# Altium project FPGAging_Lite.PrjPcb
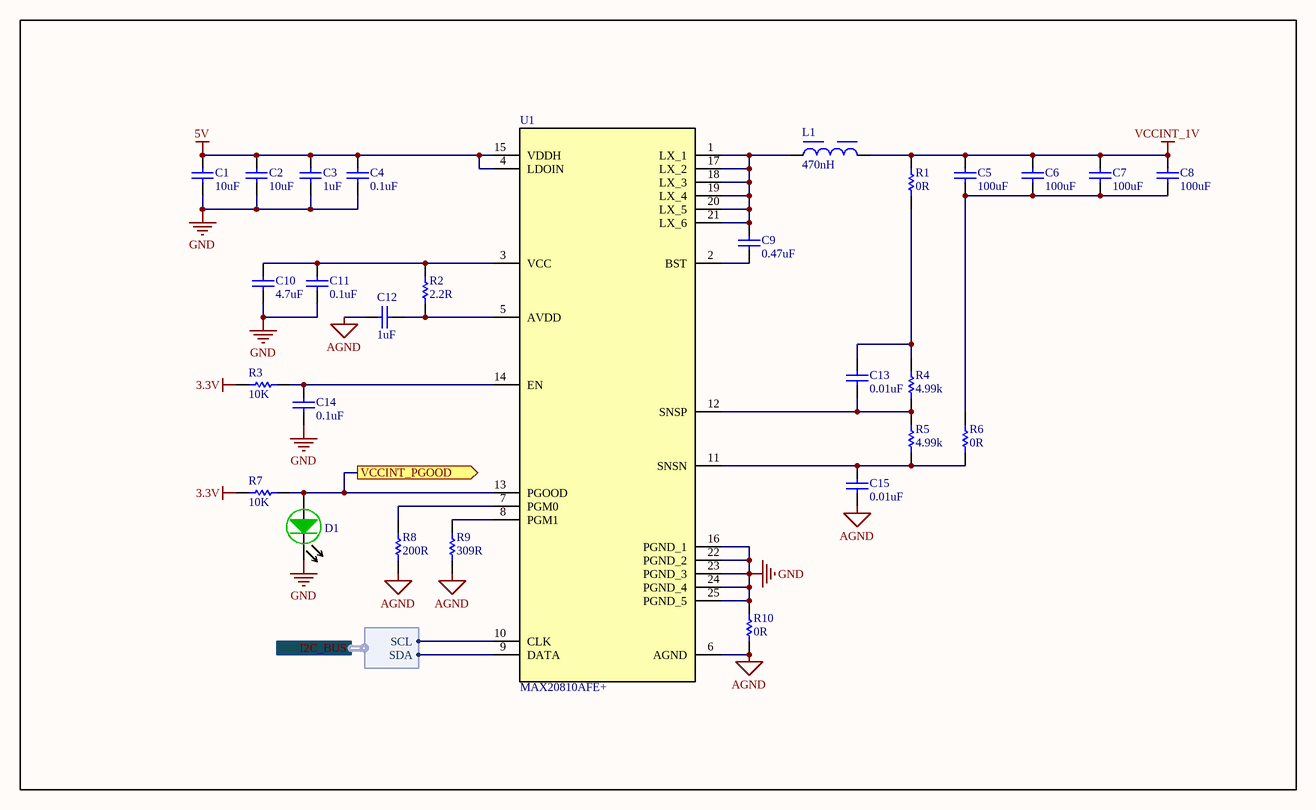
[diagram p0: 01 - POWER SUPPLY.SchDoc]
7 sheets, 221 parts. Net scope: flat (ports and power ports of the same name join across sheets).
Board file: PCB1.PcbDoc
Sheets:
  01 - POWER SUPPLY.SchDoc
  02 - AUX_POWER_SUPPLIES.SchDoc
  03 - FPGA_POWER.SchDoc
  04 - SRAM_FLASH.SchDoc
  05 - MCU.SchDoc
  06 - JTAG.SchDoc
  07 - CONNECTOR_CSKB.SchDoc

## Sheet 01 - POWER SUPPLY.SchDoc
size A3; SheetNumber: 1; SheetTotal: 7

### Parts
C1  value 10uF  [0603-C-R]  (hidden comment: CAP SMD 0603 10uF 10V ±10%)
C2  value 10uF  [0603-C-R]  (hidden comment: CAP SMD 0603 10uF 10V ±10%)
C3  value 1uF  [0402-C-R]  (hidden comment: GRM155R61E105KA12D)
C4  CAPACITANCE: 0.1uF  [0402-C-R]  (hidden comment: GRM155R71C104KA88J)
C5  value 100uF  [1210-C-R]  (hidden comment: GRT32EC70J107ME13L)
C6  value 100uF  [1210-C-R]  (hidden comment: GRT32EC70J107ME13L)
C7  value 100uF  [1210-C-R]  (hidden comment: GRT32EC70J107ME13L)
C8  value 100uF  [1210-C-R]  (hidden comment: GRT32EC70J107ME13L)
C9  CAPACITANCE: 0.47uF  [0402-C-R]  (hidden comment: CGA2B1X7S1C474K050BC)
C10  value 4.7uF  [0402-C-R]  (hidden comment: GRM155D81C475ME15J)
C11  CAPACITANCE: 0.1uF  [0402-C-R]  (hidden comment: GRM155R71C104KA88J)
C12  value 1uF  [0402-C-R]  (hidden comment: JMK105BJ105KV-F)
C13  value 0.01uF  [0402-C-R]  (hidden comment: GRM155R71C103KA01D)
C14  CAPACITANCE: 0.1uF  [0402-C-R]  (hidden comment: GRM155R71C104KA88J)
C15  value 0.01uF  [0402-C-R]  (hidden comment: GRM155R71C103KA01D)
D1  LNJ347W83RA  [LED_0402]  (value not drawn)
L1  value 470nH  [WE-HCI_1365]  (hidden comment: 744355147)
R1  value 0R  [0402-R-R]  (hidden comment: RMCF0402ZT0R00)
R2  value 2.2R  [0402-R-R]  (hidden comment: RC0402FR-072R2L)
R3  value 10K  [0402-R-R]  (hidden comment: RC0402FR-0710KL)
R4  Resistence: 4.99k  [0402-R-R]  (hidden comment: RMCF0402FT4K99)
R5  Resistence: 4.99k  [0402-R-R]  (hidden comment: RMCF0402FT4K99)
R6  value 0R  [0402-R-R]  (hidden comment: RMCF0402ZT0R00)
R7  value 10K  [0402-R-R]  (hidden comment: RC0402FR-0710KL)
R8  value 200R  [0402-R-R]  (hidden comment: CRCW0402200RFKED)
R9  value 309R  [0402-R-R]  (hidden comment: RC0402FR-072R2L)
R10  value 0R  [0402-R-R]  (hidden comment: RMCF0402ZT0R00)
U1  MAX20810AFE+  [MAX20810AFE]

### Ports
I2C_BUS (harness I2C), VCCINT_PGOOD (out)

### Harnesses
I2C: SCL, SDA

### Nets
3.3V: R3.2 R7.1
5V: C1.2 C2.2 C3.2 C4.2 U1.4(LDOIN) U1.15(VDDH)
AGND: C12.2 C15.1 R8.1 R9.1 R10.1 U1.6(AGND)
GND: C1.1 C2.1 C3.1 C4.1 C10.1 C11.1 C14.1 D1.1(K) R10.2 U1.16(PGND_1) U1.22(PGND_2) U1.23(PGND_3) U1.24(PGND_4) U1.25(PGND_5)
VCCINT_1V: C5.2 C6.2 C7.2 C8.2 L1.2 R1.1
NetC5_1: C5.1 C6.1 C7.1 C8.1 R6.1
NetC9_1: C9.1 U1.2(BST)
NetC9_2: C9.2 L1.1 U1.1(LX_1) U1.17(LX_2) U1.18(LX_3) U1.19(LX_4) U1.20(LX_5) U1.21(LX_6)
NetC10_2: C10.2 C11.2 R2.2 U1.3(VCC)
NetC12_1: C12.1 R2.1 U1.5(AVDD)
NetC13_1: C13.1 R4.1 R5.2 U1.12(SNSP)
NetC13_2: C13.2 R1.2 R4.2
NetC14_2: C14.2 R3.1 U1.14(EN)
NetC15_2: C15.2 R5.1 R6.2 U1.11(SNSN)
NetD1_2: D1.2(A) R7.2 U1.13(PGOOD) ; port VCCINT_PGOOD
NetR8_2: R8.2 U1.7(PGM0)
NetR9_2: R9.2 U1.8(PGM1)
NetR15_1: U1.9(DATA) ; port I2C_BUS.SDA
NetR16_1: U1.10(CLK) ; port I2C_BUS.SCL

### Notes on the sheet
- Nome da Sheet:
- Data:
- Projetista:
- PCB Design:
- LESC - Laboratório de Engenharia e Sistemas de Computação
- Campus do Pici - Bloco 723, S/N - Pici, Fortaleza - CE, 60455-970
- Julio Vitorino
- Revision:
- Size:

### Library data of the parts
C1 C2 = CAP SMD 0603 10uF 10V ±10%: CAP SMD 0603 MLCC GERAL 10uF 10V ±10% X7R PN: GRM188Z71A106KA73D; SIZE: 0603; PN: GRM188Z71A106KA73D; VOLTAGE: 10V; TOLERANCE: 10%
C3 = CAP SMD 0402 1uF 25V ±10%: CAP SMD 0402 MLCC GERAL 1uF 25V ±10% 0402 X5R PN:GRM155R61E105KA12D MURATA; SIZE: 0402; VOLTAGE: 25V; TOLERANCE: 10%; PN: GRM155R61E105KA12D
C4 C11 C14 = CAP CER 0.1UF 16V X7R 0402: 0.1 µF ±10% 16V Ceramic Capacitor X7R 0402 (1005 Metric) / PN: GRM155R71C104KA88J; Mfr_Name: Murata; PN: GRM155R71C104KA88J
C5-C8 = CAP SMD 1210 100uF 6.3V X7S ±20%: CAP SMD 1210 MLCC GERAL 100uF 6.3V ±20% X7S PN: GRM31CD80J107MEA8K; SIZE: 1210; VOLTAGE: 6.3V; TOLERANCE: 20%; PN: GRT32EC70J107ME13L
C9 = CAP CER 0.47UF 16V X7S 0402: 0.1 µF ±10% 16V Ceramic Capacitor X7R 0402 (1005 Metric) / PN: CGA2B1X7S1C474K050BC; Mfr_Name: Murata; PN: CGA2B1X7S1C474K050BC
C10 = CAP CER 4.7UF 25V X5R 0402: CAP SMD 0402 MLCC GERAL 4.7uF 25V ±20% 0402 X5s PN: GRM155D81C475ME15J MURATA; SIZE: 0402; VOLTAGE: 25V; TOLERANCE: 20%; PN: GRM155D81C475ME15J
C12 = CAP CER 1UF 6.3V X5R 0402: 1 µF ±10% 6.3V Ceramic Capacitor X5R 0402 (1005 Metric); SIZE: 0402; VOLTAGE: 6.3V; TOLERANCE: 10%; PN: JMK105BJ105KV-F
C13 C15 = CAP CER 10000PF 16V X7R 0402: 10000 pF ±10% 16V Ceramic Capacitor X7R 0402 (1005 Metric); SIZE: 0402; VOLTAGE: 16V; TOLERANCE: 10%; PN: GRM155R71C103KA01D
D1 = LED GREEN 0402 SMD: Green 572nm LED Indication - Discrete 1.95V 0402 (1005 Metric); ID: ?; PN: LNJ347W83RA
L1 = IND 470NH 30A 0.67 MOHM: FIXED IND 470NH 30A 0.67 MOHM PN: 744355147; MF: {'manufacturer': u'W\xfcrth Elektronik'}; Package: None; Price: None; PN: 744355147; Availability: Unavailable
R1 R6 R10 = RES SMD 0402 0R 0.063W ±1%: RES SMD GERAL FILM 0R 0.063W ±1% 0402 7" TAPE PN: RMCF0402ZT0R00 STACKPOLE; PACK: 0402; TOLERANCE: 1%; POWER: 0.063W; PN: RMCF0402ZT0R00
R2 = RES SMD 0402 2.2R 0.063W ±1%: RES SMD GERAL FILM 2.2R 0.063W ±1% 0402 7" TAPE PN: RC0402FR-072R2L; PACK: 0402; POWER: 0.063W; TOLERANCE: 1%; PN: RC0402FR-072R2L
R3 R7 = RES 10K OHM 1% 1/16W 0402: 10 kOhms ±1% 0,063W, 1/16W Resistor de chip 0402 (métrico 1005) Resistente à umidade Filme grosso; PACK: 0402; POWER: 0.063W; TOLERANCE: 1%; PN: RC0402FR-0710KL
R4 R5 = RES SMD 4K99 OHM 1% 1/16W 0402: 4.99 kOhms ±0.1% 0.063W, 1/16W Chip Resistor 0402 (1005 Metric) Automotive AEC-Q200 Thin Film; Mfr_Name: Yageo; Tolerance: 1%; PN: RMCF0402FT4K99
R8 = RES SMD 0402 200R 0.063W ±1%: RES SMD GERAL FILM 200R 0.063W ±1% 0402 7" TAPE PN: CRCW0402200RFKED; PACK: 0402; POWER: 0.063W; TOLERANCE: 1%; PN: CRCW0402200RFKED
R9 = RES SMD 0402 309R 0.063W ±1%: RES SMD GERAL FILM 309R 0.063W ±1% 0402 7" TAPE PN: RC0402FR-072R2L; PACK: 0402; PN: RC0402FR-07309RL; POWER: 0.063W; TOLERANCE: 1%
U1 = IC REG BUCK ADJ 10A 16FC2QFN: IC REG BUCK ADJ 10A 16FC2QFN PN:MAX20810AFE+; Manufacturer_Name: Analog Devices; Datasheet Link: https://www.digikey.com/en/products/detail/analog-devices-inc-maxim-integrated/MAX20810AFE/22463000?msockid=2ab7f999c9c96f4c2a13ec8dc8dd6eef; Height: 0.75mm; Mouser Part Number: 700-MAX20810AFE+; Mouser Price/Stock: https://www.mouser.co.uk/ProductDetail/Analog-Devices-Maxim-Integrated/MAX20810AFE%2b?qs=ST9lo4GX8V1Nvp4d0%2FgnXQ%3D%3D; PN: MAX20810AFE+; Description: 10A

## Sheet 02 - AUX_POWER_SUPPLIES.SchDoc
size A3; SheetNumber: 2; SheetTotal: 7
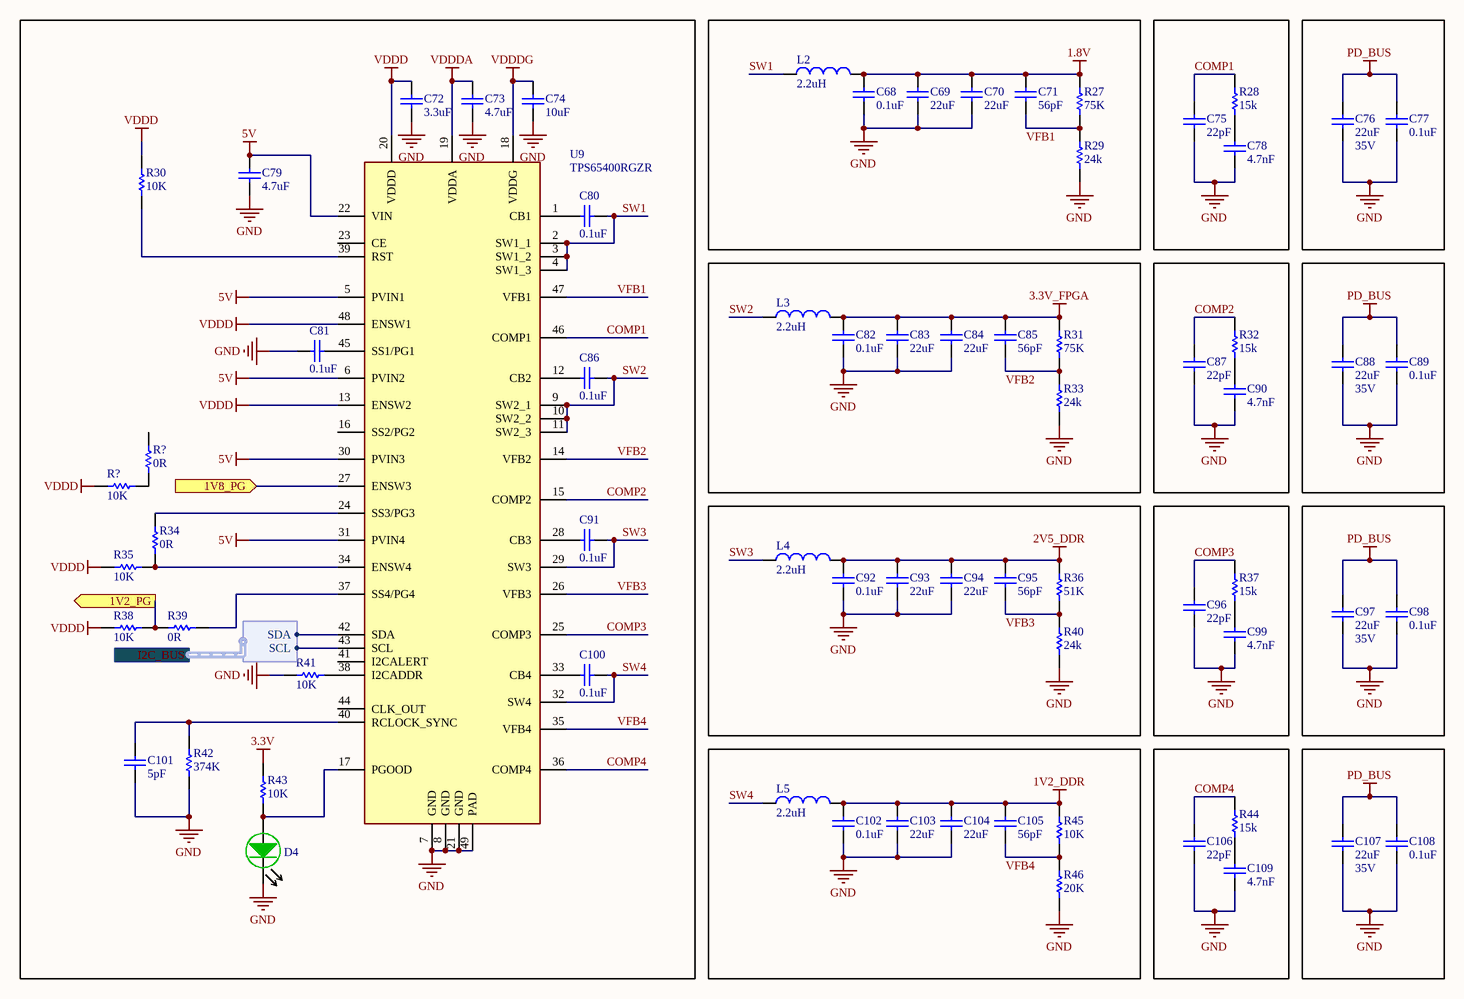
[diagram p1: 02 - AUX_POWER_SUPPLIES.SchDoc]

### Parts
(Parts that share a designator on the sheet are numbered #1, #2 ... from top to bottom, then left to right.)
C68  CAPACITANCE: 0.1uF  [0402-C-R]  (hidden comment: GRM155R71C104KA88J)
C69  value 22uF  [0603-C-R]  (hidden comment: GRM188R61A226ME15D)
C70  value 22uF  [0603-C-R]  (hidden comment: GRM188R61A226ME15D)
C71  value 56pF  [0402-C-R]  (hidden comment: GCM1555C1H560JA16D)
C72  value 3.3uF  [0402-C-R]  (hidden comment: C1005X5R1A335K050BC)
C73  value 4.7uF  [0402-C-R]  (hidden comment: GRM155D81C475ME15J)
C74  value 10uF  [0603-C-R]  (hidden comment: CAP SMD 0603 10uF 10V ±10%)
C75  value 22pF  [0402-C-R]  (hidden comment: GRM1555C1H220JA01D)
C76  value 22uF  VOLTAGE: 35V  [0805-C-R]  (hidden comment: C2012X5R1V226M125AC)
C77  value 0.1uF  [0402-C-R]  (hidden comment: GRM155R61E104KA87D)
C78  value 4.7nF  [0402-C-R]  (hidden comment: GRM155R71H472KA01D)
C79  value 4.7uF  [0402-C-R]  (hidden comment: GRM155D81C475ME15J)
C80  CAPACITANCE: 0.1uF  [0402-C-R]  (hidden comment: GRM155R71C104KA88J)
C81  value 0.1uF  [0402-C-R]  (hidden comment: GRM155R61E104KA87D)
C82  CAPACITANCE: 0.1uF  [0402-C-R]  (hidden comment: GRM155R71C104KA88J)
C83  value 22uF  [0603-C-R]  (hidden comment: GRM188R61A226ME15D)
C84  value 22uF  [0603-C-R]  (hidden comment: GRM188R61A226ME15D)
C85  value 56pF  [0402-C-R]  (hidden comment: GCM1555C1H560JA16D)
C86  CAPACITANCE: 0.1uF  [0402-C-R]  (hidden comment: GRM155R71C104KA88J)
C87  value 22pF  [0402-C-R]  (hidden comment: GRM1555C1H220JA01D)
C88  value 22uF  VOLTAGE: 35V  [0805-C-R]  (hidden comment: C2012X5R1V226M125AC)
C89  value 0.1uF  [0402-C-R]  (hidden comment: GRM155R61E104KA87D)
C90  value 4.7nF  [0402-C-R]  (hidden comment: GRM155R71H472KA01D)
C91  CAPACITANCE: 0.1uF  [0402-C-R]  (hidden comment: GRM155R71C104KA88J)
C92  CAPACITANCE: 0.1uF  [0402-C-R]  (hidden comment: GRM155R71C104KA88J)
C93  value 22uF  [0603-C-R]  (hidden comment: GRM188R61A226ME15D)
C94  value 22uF  [0603-C-R]  (hidden comment: GRM188R61A226ME15D)
C95  value 56pF  [0402-C-R]  (hidden comment: GCM1555C1H560JA16D)
C96  value 22pF  [0402-C-R]  (hidden comment: GRM1555C1H220JA01D)
C97  value 22uF  VOLTAGE: 35V  [0805-C-R]  (hidden comment: C2012X5R1V226M125AC)
C98  value 0.1uF  [0402-C-R]  (hidden comment: GRM155R61E104KA87D)
C99  value 4.7nF  [0402-C-R]  (hidden comment: GRM155R71H472KA01D)
C100  CAPACITANCE: 0.1uF  [0402-C-R]  (hidden comment: GRM155R71C104KA88J)
C101  value 5pF  [0402-C-R]  (hidden comment: GRM1555C1H5R0BA01D)
C102  CAPACITANCE: 0.1uF  [0402-C-R]  (hidden comment: GRM155R71C104KA88J)
C103  value 22uF  [0603-C-R]  (hidden comment: GRM188R61A226ME15D)
C104  value 22uF  [0603-C-R]  (hidden comment: GRM188R61A226ME15D)
C105  value 56pF  [0402-C-R]  (hidden comment: GCM1555C1H560JA16D)
C106  value 22pF  [0402-C-R]  (hidden comment: GRM1555C1H220JA01D)
C107  value 22uF  VOLTAGE: 35V  [0805-C-R]  (hidden comment: C2012X5R1V226M125AC)
C108  value 0.1uF  [0402-C-R]  (hidden comment: GRM155R61E104KA87D)
C109  value 4.7nF  [0402-C-R]  (hidden comment: GRM155R71H472KA01D)
D4  150060GS75000  [LED0603]  (value not drawn)
L2  value 2.2uH  [IND_SRP4020TA-2R2M]  (hidden comment: IND 2.2UH 4A 61 MOHM SMD)
L3  value 2.2uH  [IND_SRP4020TA-2R2M]  (hidden comment: IND 2.2UH 4A 61 MOHM SMD)
L4  value 2.2uH  [IND_SRP4020TA-2R2M]  (hidden comment: IND 2.2UH 4A 61 MOHM SMD)
L5  value 2.2uH  [IND_SRP4020TA-2R2M]  (hidden comment: IND 2.2UH 4A 61 MOHM SMD)
R27  Resistence: 75K  [0402-R-R]  (hidden comment: ERA-2AEB753X)
R28  value 15k  [0402-R-R]  (hidden comment: ERJ-2RKF1502X)
R29  Resistence: 24k  [0402-R-R]  (hidden comment: RT0402BRD0724KL)
R30  Resistence: 10K  [0402-R-R]  (hidden comment: RC0402JR-0710KL)
R31  Resistence: 75K  [0402-R-R]  (hidden comment: ERA-2AEB753X)
R32  value 15k  [0402-R-R]  (hidden comment: ERJ-2RKF1502X)
R33  Resistence: 24k  [0402-R-R]  (hidden comment: RT0402BRD0724KL)
R34  value 0R  [0402-R-R]  (hidden comment: RMCF0402ZT0R00)
R35  value 10K  [0402-R-R]  (hidden comment: RC0402FR-0710KL)
R36  Resistence: 51K  [0402-R-R]  (hidden comment: ERJ-2RKF5102X)
R37  value 15k  [0402-R-R]  (hidden comment: ERJ-2RKF1502X)
R38  value 10K  [0402-R-R]  (hidden comment: RC0402FR-0710KL)
R39  value 0R  [0402-R-R]  (hidden comment: RMCF0402ZT0R00)
R40  Resistence: 24k  [0402-R-R]  (hidden comment: RT0402BRD0724KL)
R41  Resistence: 10K  [0402-R-R]  (hidden comment: RC0402JR-0710KL)
R42  Resistence: 374K  [0402-R-R]  (hidden comment: RC0402FR-07374KL)
R43  value 10K  [0402-R-R]  (hidden comment: RC0402FR-0710KL)
R44  value 15k  [0402-R-R]  (hidden comment: ERJ-2RKF1502X)
R45  Resistence: 10K  [0402-R-R]  (hidden comment: RC0402JR-0710KL)
R46  Resistence: 20K  [0402-R-R]  (hidden comment: ERJ-2RKF2002X)
R?#1  value 10K  [0402-R-R]  (hidden comment: RC0402FR-0710KL)
R?#2  value 0R  [0402-R-R]  (hidden comment: RMCF0402ZT0R00)
U9  TPS65400RGZR  [QFN50P700X700X100-49N-D]

### Ports
1V2_PG (out), 1V8_PG (in), I2C_BUS (harness I2C)

### Harnesses
I2C: SCL, SDA

### Nets
1.8V: C68.2 C69.2 C70.2 C71.2 L2.2 R27.2
1V2_DDR: C102.2 C103.2 C104.2 C105.2 L5.2 R45.2
2V5_DDR: C92.2 C93.2 C94.2 C95.2 L4.2 R36.2
3.3V: R43.2
3.3V_FPGA: C82.2 C83.2 C84.2 C85.2 L3.2 R31.2
5V: C79.2 U9.5(PVIN1) U9.6(PVIN2) U9.22(VIN) U9.30(PVIN3) U9.31(PVIN4)
GND: C68.1 C69.1 C70.1 C72.1 C73.1 C74.1 C75.2 C76.1 C77.1 C78.2 C79.1 C81.1 C82.1 C83.1 C84.1 C87.2 C88.1 C89.1 C90.2 C92.1 C93.1 C94.1 C96.2 C97.1 C98.1 C99.2 C101.1 C102.1 C103.1 C104.1 C106.2 C107.1 C108.1 C109.2 D4.1(K) R29.1 R33.1 R40.1 R41.1 R42.1 R46.1 U9.7(GND) U9.8(GND) U9.21(GND) U9.49(PAD)
PD_BUS: C76.2 C77.2 C88.2 C89.2 C97.2 C98.2 C107.2 C108.2
VDDD: C72.2 R30.1 R35.1 R38.1 R?#1.1 U9.13(ENSW2) U9.20(VDDD) U9.48(ENSW1)
VDDDA: C73.2 U9.19(VDDA)
VDDDG: C74.2 U9.18(VDDG)
COMP1: C75.1 R28.1 U9.46(COMP1)
COMP2: C87.1 R32.1 U9.15(COMP2)
COMP3: C96.1 R37.1 U9.25(COMP3)
COMP4: C106.1 R44.1 U9.36(COMP4)
SW1: C80.1 L2.1 U9.2(SW1_1) U9.3(SW1_2) U9.4(SW1_3)
SW2: C86.1 L3.1 U9.9(SW2_1) U9.10(SW2_2) U9.11(SW2_3)
SW3: C91.1 L4.1 U9.29(SW3)
SW4: C100.1 L5.1 U9.32(SW4)
VFB1: C71.1 R27.1 R29.2 U9.47(VFB1)
VFB2: C85.1 R31.1 R33.2 U9.14(VFB2)
VFB3: C95.1 R36.1 R40.2 U9.26(VFB3)
VFB4: C105.1 R45.1 R46.2 U9.35(VFB4)
NetC78_1: C78.1 R28.2
NetC80_2: C80.2 U9.1(CB1)
NetC81_2: C81.2 U9.45(SS1/PG1)
NetC86_2: C86.2 U9.12(CB2)
NetC90_1: C90.1 R32.2
NetC91_2: C91.2 U9.28(CB3)
NetC99_1: C99.1 R37.2
NetC100_2: C100.2 U9.33(CB4)
NetC101_2: C101.2 R42.2 U9.40(RCLOCK_SYNC)
NetC109_1: C109.1 R44.2
NetD4_2: D4.2(A) R43.1 U9.17(PGOOD)
NetR15_1: U9.42(SDA) ; port I2C_BUS.SDA
NetR16_1: U9.43(SCL) ; port I2C_BUS.SCL
NetR30_2: R30.2 U9.39(RST)
NetR34_1: R34.1 R35.2 U9.34(ENSW4)
NetR34_2: R34.2 U9.24(SS3/PG3)
NetR38_2: R38.2 R39.1 ; port 1V2_PG
NetR39_2: R39.2 U9.37(SS4/PG4)
NetR41_2: R41.2 U9.38(I2CADDR)
NetR?#1_2: R?#1.2 R?#2.1
NetU9_27: U9.27(ENSW3) ; port 1V8_PG

Not connected (* = marked no-connect by the designer): R?#2 2; U9 16(SS2/PG2) 23(CE) 41(I2CALERT) 44(CLK_OUT)

### Notes on the sheet
- Nome da Sheet:
- Data:
- Projetista:
- PCB Design:
- LESC - Laboratório de Engenharia e Sistemas de Computação
- Campus do Pici - Bloco 723, S/N - Pici, Fortaleza - CE, 60455-970
- Julio Vitorino
- Revision:
- Size:

### Library data of the parts
C68 C80 C82 C86 C91 C92 C100 C102 = CAP CER 0.1UF 16V X7R 0402: as C4 on sheet 01 - POWER SUPPLY; PN: GRM155R71C104KA88J
C69 C70 C83 C84 C93 C94 C103 C104 = CAP CER 22UF 10V X5R 0603: 22 µF ±20% 10V Ceramic Capacitor X5R 0603 (1608 Metric); SIZE: 0603; PN: GRM188R61A226ME15D; VOLTAGE: 10V; TOLERANCE: 20%
C71 C85 C95 C105 = CAP CER 56PF 50V C0G/NP0 0402: 56 pF ±5% 50V Ceramic Capacitor C0G, NP0 0402 (1005 Metric); SIZE: 0402; PN: GCM1555C1H560JA16D; VOLTAGE: 50V; TOLERANCE: 5%
C72 = CAP CER 3.3UF 10V X5R 0402: 3.3 µF ±10% 10V Ceramic Capacitor X5R 0402 (1005 Metric); SIZE: 0402; PN: C1005X5R1A335K050BC; VOLTAGE: 10V; TOLERANCE: 10%
C73 C79 = CAP CER 4.7UF 25V X5R 0402: as C10 on sheet 01 - POWER SUPPLY; SIZE: 0402; VOLTAGE: 25V; TOLERANCE: 20%; PN: GRM155D81C475ME15J
C74 = CAP SMD 0603 10uF 10V ±10%: as C1 on sheet 01 - POWER SUPPLY; SIZE: 0603; PN: GRM188Z71A106KA73D; VOLTAGE: 10V; TOLERANCE: 10%
C75 C87 C96 C106 = CAP CER 22PF 50V C0G/NPO 0402: 22 pF ±5% 50V Ceramic Capacitor C0G, NP0 0402 (1005 Metric); SIZE: 0402; PN: GRM1555C1H220JA01D; VOLTAGE: 50V; TOLERANCE: 5%
C76 C88 C97 C107 = CAP CER 22UF 35V X5R 0805: 22 µF ±20% 35V Ceramic Capacitor X5R 0805 (2012 Metric); SIZE: 0603; PN: C2012X5R1V226M125AC; TOLERANCE: 20%
C77 C81 C89 C98 C108 = CAP CER 0.1UF 25V X5R 0402: 0.1 µF ±10% 25V Ceramic Capacitor X5R 0402 (1005 Metric); SIZE: 0402; PN: GRM155R61E104KA87D; VOLTAGE: 25V; TOLERANCE: 10%
C78 C90 C99 C109 = CAP CER 4700PF 50V X7R 0402: 4700 pF ±10% 50V Capacitor de cerâmica X7R 0402 PN: GRM155R71H472KA01D; SIZE: 0402; PN: GRM155R71H472KA01D; VOLTAGE: 50V; TOLERANCE: 10%
C101 = CAP CER 5PF 50V C0G/NP0 0402: 5 pF ±0.1pF 50V Ceramic Capacitor C0G, NP0 0402 (1005 Metric); PN: C1005X5R1A335K050BC; TOLERANCE: 2%; SIZE: 0402; VOLTAGE: 50V
D4 = LED SMD VD 0603: LED SMD VD ALTO BRILHO 1,6x0,8x0,8mm 430mcd PN:150060GS75000 0603 WURTH; ID: ?; PN: 150060GS75000
L2-L5 = IND 2.2UH 4A 61 MOHM SMD: FIXED IND 2.2UH 4A 61 MOHM SMD PN: SRP4020TA-2R2M; MF: Murata Electronics; PN: SRP4020TA-2R2M; Package: 1608 ICS; DigiKey-Purchase-URL: https://snapeda.com/shop?store=DigiKey&id=4221634; Mouser-Purchase-URL: https://snapeda.com/shop?store=Mouser&id=4221634; SnapEDA_Link: https://www.snapeda.com/parts/DFE18SAN1R0ME0L/Applied%20Avionics/view-part/4221634/?ref=snap; Part Number: SRP4020TA-2R2M
R27 R31 = RES SMD 75K OHM 0.1% 1/16W 0402: 75 kOhms ±0.1% 0.063W, 1/16W Chip Resistor 0402 (1005 Metric) Automotive AEC-Q200 Thin Film; Mfr_Name: Panasonic; PN: ERA-2AEB753X; Tolerance: 0.1%
R28 R32 R37 R44 = RES SMD 15K OHM 1% 1/10W 0402: 15 kOhms ±1% 0.1W, 1/10W Chip Resistor 0402 (1005 Metric) Automotive AEC-Q200 Thick Film; PACK: 0402; TOLERANCE: 1%; POWER: 0.1W; PN: ERJ-2RKF1502X
R29 R33 R40 = RES SMD 24K OHM 0.1% 1/16W 0402: 24 kOhms ±0.1% 0.063W, 1/16W Chip Resistor 0402 (1005 Metric) Thin Film; Mfr_Name: Yageo; PN: RT0402BRD0724KL; Tolerance: 0.1%
R30 R41 R45 = RES 10K OHM 5% 1/16W 0402: 10 kOhms ±5% 0.063W, 1/16W Chip Resistor 0402 (1005 Metric) Moisture Resistant Thick Film; Mfr_Name: Yageo; PN: RC0402JR-0710KL; Tolerance: 5%
R34 R39 R?#2 = RES SMD 0402 0R 0.063W ±1%: as R1 on sheet 01 - POWER SUPPLY; TOLERANCE: 1%; POWER: 0.063W; PN: RMCF0402ZT0R00
R35 R38 R43 R?#1 = RES 10K OHM 1% 1/16W 0402: as R3 on sheet 01 - POWER SUPPLY; TOLERANCE: 1%; PN: RC0402FR-0710KL
R36 = RES SMD 51K OHM 1% 1/10W 0402: 51 kOhms ±1% 0.1W, 1/10W Chip Resistor 0402 (1005 Metric) Automotive AEC-Q200 Thick Film; Mfr_Name: Panasonic; PN: ERJ-2RKF5102X; Tolerance: 1%
R42 = RES 374K OHM 1% 1/16W 0402: 374 kOhms ±1% 0.063W, 1/16W Chip Resistor 0402 (1005 Metric) Moisture Resistant Thick Film; Mfr_Name: Yageo; PN: RC0402FR-07374KL; Tolerance: 1%
R46 = RES SMD 20K OHM 1% 1/10W 0402: 20 kOhms ±1% 0.1W, 1/10W Chip Resistor 0402 (1005 Metric) Automotive AEC-Q200 Thick Film; Mfr_Name: Panasonic; PN: ERJ-2RKF2002X; Tolerance: 1%
U9 = IC REG BCK ADJ 4A/2A QUAD 48VQFN: Buck CI regulador de chaveamento Positivo Ajustável 0,6V 4 Saída 4A, 2A 48-VFQFN pad exposto; Manufacturer_Name: Texas Instruments; Geometry.Height: 1mm; Mouser Part Number: 595-TPS65400RGZR; Mouser Price/Stock: https://www.mouser.co.uk/ProductDetail/Texas-Instruments/TPS65400RGZR?qs=Lb6%252B0IsOw4%252Bg1%252BfY7t6%252Bmw%3D%3D; Datasheet Link: http://www.ti.com/lit/gpn/tps65400; PN: TPS65400RGZR

## Sheet 03 - FPGA_POWER.SchDoc
size A4; SheetNumber: 3; SheetTotal: 7
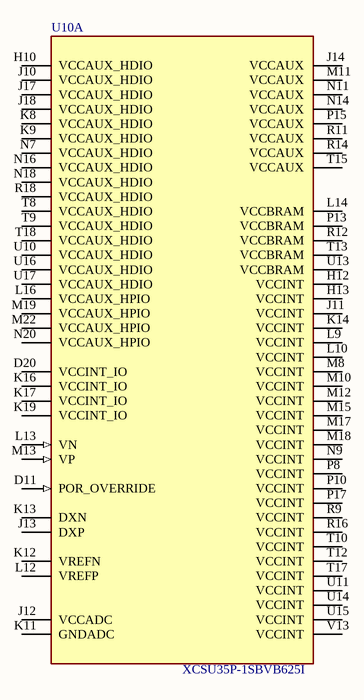
[diagram p2: 03 - FPGA_POWER.SchDoc]

### Parts
U10  PN: XCSU35P-1SBVB625I  [BGA625C80P25X25_2100X2100X192]  (hidden comment: IC FPGA 304 I/O 625-BGA/FCBGA)  (part A of 11)

### Nets

Not connected (* = marked no-connect by the designer): U10 D11(POR_OVERRIDE) D20(VCCINT_IO) H10(VCCAUX_HDIO) H12(VCCINT) H13(VCCINT) J10(VCCAUX_HDIO) J11(VCCINT) J12(VCCADC) J13(DXP) J14(VCCAUX) J17(VCCAUX_HDIO) J18(VCCAUX_HDIO) K8(VCCAUX_HDIO) K9(VCCAUX_HDIO) K11(GNDADC) K12(VREFN) K13(DXN) K14(VCCINT) K16(VCCINT_IO) K17(VCCINT_IO) K19(VCCINT_IO) L9(VCCINT) L10(VCCINT) L12(VREFP) L13(VN) L14(VCCBRAM) L16(VCCAUX_HPIO) M8(VCCINT) M10(VCCINT) M11(VCCAUX) M12(VCCINT) M13(VP) M15(VCCINT) M17(VCCINT) M18(VCCINT) M19(VCCAUX_HPIO) M22(VCCAUX_HPIO) N7(VCCAUX_HDIO) N9(VCCINT) N11(VCCAUX) N14(VCCAUX) N16(VCCAUX_HDIO) N18(VCCAUX_HDIO) N20(VCCAUX_HPIO) P8(VCCINT) P10(VCCINT) P13(VCCBRAM) P15(VCCAUX) P17(VCCINT) R9(VCCINT) R11(VCCAUX) R12(VCCBRAM) R14(VCCAUX) R16(VCCINT) R18(VCCAUX_HDIO) T8(VCCAUX_HDIO) T9(VCCAUX_HDIO) T10(VCCINT) T12(VCCINT) T13(VCCBRAM) T15(VCCAUX) T17(VCCINT) T18(VCCAUX_HDIO) U10(VCCAUX_HDIO) U11(VCCINT) U13(VCCBRAM) U14(VCCINT) U15(VCCINT) U16(VCCAUX_HDIO) U17(VCCAUX_HDIO) V13(VCCINT)

### Notes on the sheet
- LESC - Laboratório de Engenharia e Sistemas de Computação
- Nome da Sheet:
- Data:
- Projetista:
- PCB Design:
- Campus do Pici - Bloco 723, S/N - Pici, Fortaleza - CE, 60455-970
- Julio Vitorino
- Revision:
- Size:
- A4

### Library data of the parts
U10 = IC FPGA 304 I/O 625-BGA/FCBGA: IC FPGA 304 I/O 625-BGA/FCBGA PN: XCSU35P-1SBVB625I; MF: AMD; Package: None; Price: None; Value: *; SnapEDA_Link: https://www.snapeda.com/parts/XCSU10P-2SBVB625I/AMD/view-part/?ref=snap; Availability: Unavailable; Check_prices: https://www.snapeda.com/parts/XCSU10P-2SBVB625I/AMD/view-part/?ref=eda

## Sheet 04 - SRAM_FLASH.SchDoc
size A4; SheetNumber: 4; SheetTotal: 7
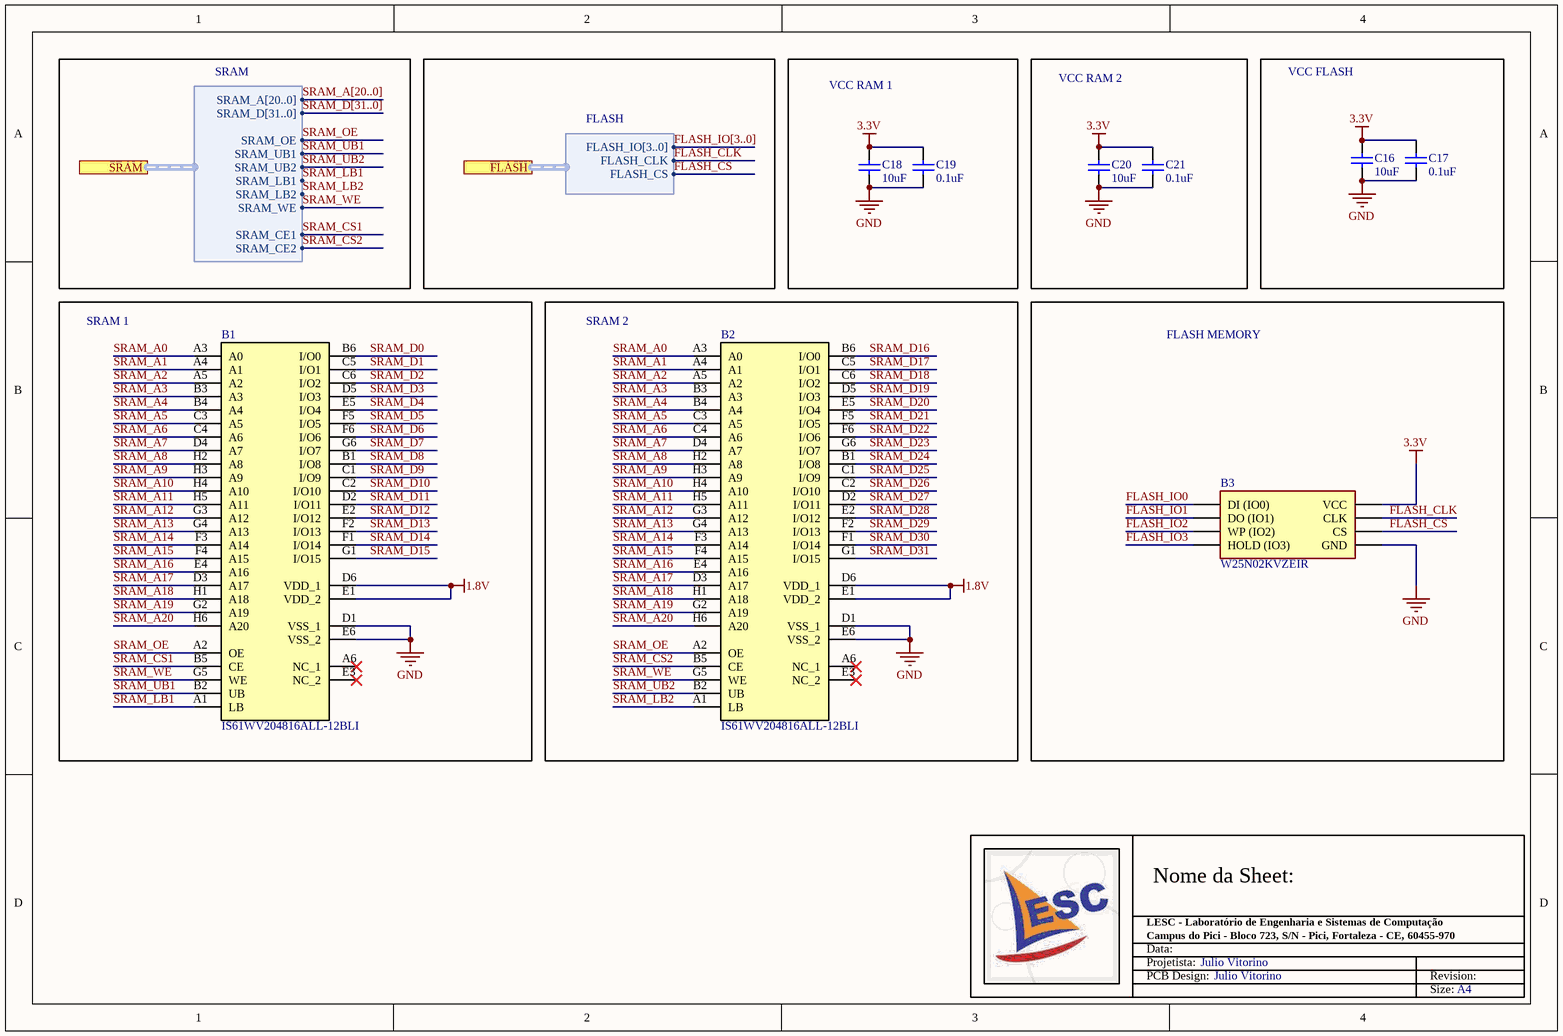
[diagram p3: 04 - SRAM_FLASH.SchDoc]

### Parts
B1  IS61WV204816ALL-12BLI  [BGA48C75P6X8_600X800X120]
B2  IS61WV204816ALL-12BLI  [BGA48C75P6X8_600X800X120]
B3  W25N02KVZEIR  [SON127P800X600X80-9N]
C16  CAPACITANCE: 10uF  [0402-C-R]  (hidden comment: CAP CER 10UF 6.3V X5R 0402)
C17  CAPACITANCE: 0.1uF  [0402-C-R]  (hidden comment: GRM155R71C104KA88J)
C18  CAPACITANCE: 10uF  [0402-C-R]  (hidden comment: CAP CER 10UF 6.3V X5R 0402)
C19  CAPACITANCE: 0.1uF  [0402-C-R]  (hidden comment: GRM155R71C104KA88J)
C20  CAPACITANCE: 10uF  [0402-C-R]  (hidden comment: CAP CER 10UF 6.3V X5R 0402)
C21  CAPACITANCE: 0.1uF  [0402-C-R]  (hidden comment: GRM155R71C104KA88J)

### Blocks framed on the sheet
VCC RAM 1: C18 C19
VCC RAM 2: C20 C21
VCC FLASH: C16 C17
SRAM 1: B1
SRAM 2: B2
FLASH MEMORY: B3

### Ports
FLASH (harness FLASH), SRAM (harness SRAM)

### Harnesses
SRAM: SRAM_A[20..0], SRAM_D[31..0], SRAM_OE, SRAM_UB1, SRAM_UB2, SRAM_WE, SRAM_CE1, SRAM_CE2, SRAM_LB2, SRAM_LB1
FLASH: FLASH_IO[3..0], FLASH_CLK, FLASH_CS

### Nets
1.8V: B1.D6(VDD_1) B1.E1(VDD_2) B2.D6(VDD_1) B2.E1(VDD_2)
3.3V: B3.8(VCC) C16.2 C17.2 C18.2 C19.2 C20.2 C21.2
GND: B1.D1(VSS_1) B1.E6(VSS_2) B2.D1(VSS_1) B2.E6(VSS_2) B3.4,_9(GND) C16.1 C17.1 C18.1 C19.1 C20.1 C21.1
FLASH_CLK: B3.6(CLK) ; port FLASH.FLASH_CLK
FLASH_CS: B3.1(CS) ; port FLASH.FLASH_CS
FLASH_IO0: B3.5(DI_(IO0))
FLASH_IO1: B3.2(DO_(IO1))
FLASH_IO2: B3.3(WP_(IO2))
FLASH_IO3: B3.7(HOLD_(IO3))
SRAM_A0: B1.A3(A0) B2.A3(A0)
SRAM_A1: B1.A4(A1) B2.A4(A1)
SRAM_A2: B1.A5(A2) B2.A5(A2)
SRAM_A3: B1.B3(A3) B2.B3(A3)
SRAM_A4: B1.B4(A4) B2.B4(A4)
SRAM_A5: B1.C3(A5) B2.C3(A5)
SRAM_A6: B1.C4(A6) B2.C4(A6)
SRAM_A7: B1.D4(A7) B2.D4(A7)
SRAM_A8: B1.H2(A8) B2.H2(A8)
SRAM_A9: B1.H3(A9) B2.H3(A9)
SRAM_A10: B1.H4(A10) B2.H4(A10)
SRAM_A11: B1.H5(A11) B2.H5(A11)
SRAM_A12: B1.G3(A12) B2.G3(A12)
SRAM_A13: B1.G4(A13) B2.G4(A13)
SRAM_A14: B1.F3(A14) B2.F3(A14)
SRAM_A15: B1.F4(A15) B2.F4(A15)
SRAM_A16: B1.E4(A16) B2.E4(A16)
SRAM_A17: B1.D3(A17) B2.D3(A17)
SRAM_A18: B1.H1(A18) B2.H1(A18)
SRAM_A19: B1.G2(A19) B2.G2(A19)
SRAM_A20: B1.H6(A20) B2.H6(A20)
SRAM_CS1: B1.B5(CE) ; port SRAM.SRAM_CE1
SRAM_CS2: B2.B5(CE) ; port SRAM.SRAM_CE2
SRAM_D0: B1.B6(I/O0)
SRAM_D1: B1.C5(I/O1)
SRAM_D2: B1.C6(I/O2)
SRAM_D3: B1.D5(I/O3)
SRAM_D4: B1.E5(I/O4)
SRAM_D5: B1.F5(I/O5)
SRAM_D6: B1.F6(I/O6)
SRAM_D7: B1.G6(I/O7)
SRAM_D8: B1.B1(I/O8)
SRAM_D9: B1.C1(I/O9)
SRAM_D10: B1.C2(I/O10)
SRAM_D11: B1.D2(I/O11)
SRAM_D12: B1.E2(I/O12)
SRAM_D13: B1.F2(I/O13)
SRAM_D14: B1.F1(I/O14)
SRAM_D15: B1.G1(I/O15)
SRAM_D16: B2.B6(I/O0)
SRAM_D17: B2.C5(I/O1)
SRAM_D18: B2.C6(I/O2)
SRAM_D19: B2.D5(I/O3)
SRAM_D20: B2.E5(I/O4)
SRAM_D21: B2.F5(I/O5)
SRAM_D22: B2.F6(I/O6)
SRAM_D23: B2.G6(I/O7)
SRAM_D24: B2.B1(I/O8)
SRAM_D25: B2.C1(I/O9)
SRAM_D26: B2.C2(I/O10)
SRAM_D27: B2.D2(I/O11)
SRAM_D28: B2.E2(I/O12)
SRAM_D29: B2.F2(I/O13)
SRAM_D30: B2.F1(I/O14)
SRAM_D31: B2.G1(I/O15)
SRAM_LB1: B1.A1(LB) ; port SRAM.SRAM_LB1
SRAM_LB2: B2.A1(LB) ; port SRAM.SRAM_LB2
SRAM_OE: B1.A2(OE) B2.A2(OE) ; port SRAM.SRAM_OE
SRAM_UB1: B1.B2(UB) ; port SRAM.SRAM_UB1
SRAM_UB2: B2.B2(UB) ; port SRAM.SRAM_UB2
SRAM_WE: B1.G5(WE) B2.G5(WE) ; port SRAM.SRAM_WE

Not connected (* = marked no-connect by the designer): B1 A6(NC_1)* E3(NC_2)*; B2 A6(NC_1)* E3(NC_2)*

### Buses and harness runs
bus FLASH_IO[3..0]
bus SRAM_A[20..0]
bus SRAM_D[31..0]

### Notes on the sheet
- LESC - Laboratório de Engenharia e Sistemas de Computação
- Nome da Sheet:
- Data:
- Projetista:
- PCB Design:
- Campus do Pici - Bloco 723, S/N - Pici, Fortaleza - CE, 60455-970
- Julio Vitorino
- Revision:
- Size:
- A4

### Library data of the parts
B1 B2 = IC SRAM 32MBIT PARALLEL 48TFBGA: SRAM - Asynchronous Memory IC 32Mbit Parallel 10 ns 48-TFBGA (6x8); Manufacturer_Name: Integrated Silicon Solution Inc.; Manufacturer_Part_Number: IS61WV204816BLL-10BLI; Geometry.Height: 1.2mm; Mouser Part Number: 870-WV204816BLL10BLI; Mouser Price/Stock: https://www.mouser.co.uk/ProductDetail/ISSI/IS61WV204816BLL-10BLI?qs=cttFivMKqWygmzV9oE9bxA%3D%3D; Datasheet Link: http://www.issi.com/WW/pdf/61-64WV204816BLL.pdf; PN: IS61WV204816ALL-12BLI
B3 = IC FLASH 2GBIT SPI/QUAD 8WSON: FLASH - NAND (SLC) Memory IC 2Gbit SPI - Quad I/O 104 MHz 7 ns 8-WSON (8x6) / PN: W25N02KVZEIR; Manufacturer_Name: Winbond; Geometry.Height: 0.8mm; Mouser Part Number: 454-W25N02KVZEIR; Mouser Price/Stock: https://www.mouser.co.uk/ProductDetail/Winbond/W25N02KVZEIR?qs=YwPsRIUVAOeLKi4%2F%2FEoBOQ%3D%3D; Manufacturer_Part_Number: W25N02KVZEIR; Datasheet Link: https://www.winbond.com/resource-files/W25N02KVxxIRU_Datasheet_20210625_G.pdf; PN: W25N02KVZEIR
C16 C18 C20 = CAP CER 10UF 6.3V X5R 0402: 10 µF ±20% 6.3V Ceramic Capacitor X5R 0402 (1005 Metric) / PN: GRM155R60J106ME05D; Mfr_Name: Murata; Type: Ceramic Capacitors; PN: GRM155R60J106ME05D
C17 C19 C21 = CAP CER 0.1UF 16V X7R 0402: as C4 on sheet 01 - POWER SUPPLY; PN: GRM155R71C104KA88J

## Sheet 05 - MCU.SchDoc
size A3; SheetNumber: 5; SheetTotal: 7
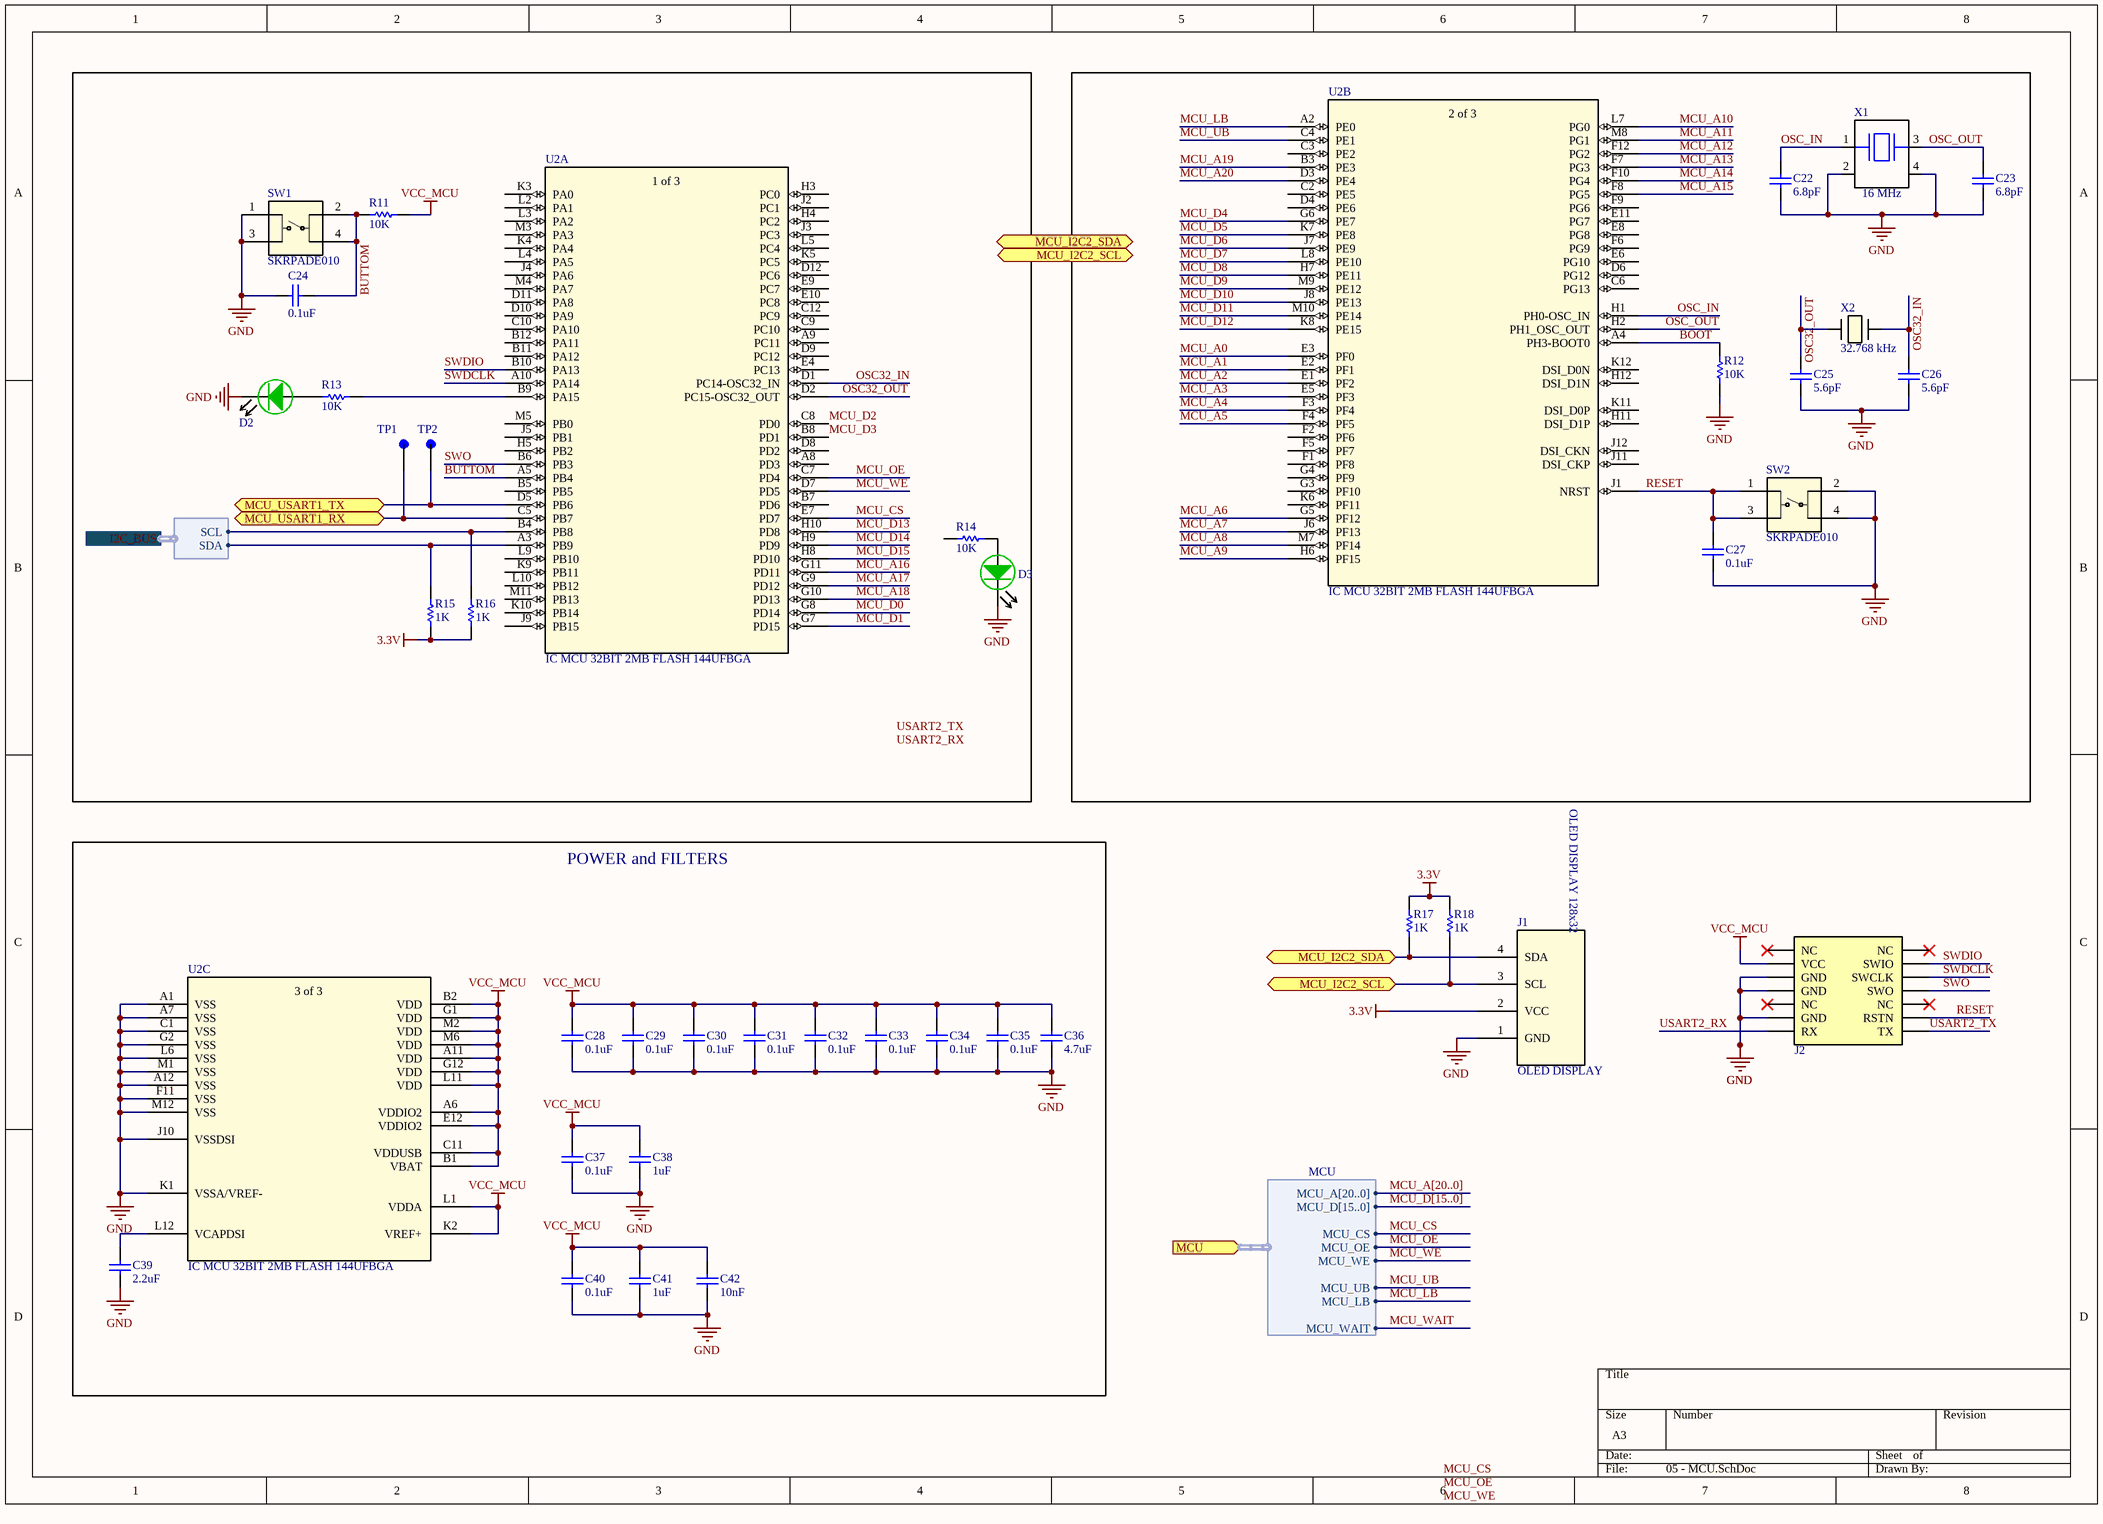
[diagram p4: 05 - MCU.SchDoc]

### Parts
C22  value 6.8pF  [0402-C-R]  (hidden comment: GRM0225C1E6R8CA03L)
C23  value 6.8pF  [0402-C-R]  (hidden comment: GRM0225C1E6R8CA03L)
C24  value 0.1uF  [0402-C-R]  (hidden comment: GRM155R61E104KA87D)
C25  value 5.6pF  [0402-C-R]  (hidden comment: CC0402BRNPO9BN5R6)
C26  value 5.6pF  [0402-C-R]  (hidden comment: CC0402BRNPO9BN5R6)
C27  value 0.1uF  [0402-C-R]  (hidden comment: GRM155R61E104KA87D)
C28  value 0.1uF  [0402-C-R]  (hidden comment: GRM155R61E104KA87D)
C29  value 0.1uF  [0402-C-R]  (hidden comment: GRM155R61E104KA87D)
C30  value 0.1uF  [0402-C-R]  (hidden comment: GRM155R61E104KA87D)
C31  value 0.1uF  [0402-C-R]  (hidden comment: GRM155R61E104KA87D)
C32  value 0.1uF  [0402-C-R]  (hidden comment: GRM155R61E104KA87D)
C33  value 0.1uF  [0402-C-R]  (hidden comment: GRM155R61E104KA87D)
C34  value 0.1uF  [0402-C-R]  (hidden comment: GRM155R61E104KA87D)
C35  value 0.1uF  [0402-C-R]  (hidden comment: GRM155R61E104KA87D)
C36  value 4.7uF  [0402-C-R]  (hidden comment: GRM155D81C475ME15J)
C37  value 0.1uF  [0402-C-R]  (hidden comment: GRM155R61E104KA87D)
C38  value 1uF  [0402-C-R]  (hidden comment: JMK105BJ105KV-F)
C39  value 2.2uF  [0402-C-R]  (hidden comment: 885012105013)
C40  value 0.1uF  [0402-C-R]  (hidden comment: GRM155R61E104KA87D)
C41  value 1uF  [0402-C-R]  (hidden comment: JMK105BJ105KV-F)
C42  value 10nF  [0402-C-R]  (hidden comment: KGM05AR71E103KH)
D2  150060GS75000  [LED0603]  (value not drawn)
D3  150060GS75000  [LED0603]  (value not drawn)
J1  OLED DISPLAY  [OLED_DISPLAY]
J2  CONN HEADER SMD 14POS 1.27MM_1  [SAMTEC_FTSH-107-01-L-DV-K-A]  (value not drawn)
R11  value 10K  [0402-R-R]  (hidden comment: RC0402FR-07560RL)
R12  value 10K  [0402-R-R]  (hidden comment: RC0402FR-0710KL)
R13  value 10K  [0402-R-R]  (hidden comment: RC0402FR-07560RL)
R14  value 10K  [0402-R-R]  (hidden comment: RC0402FR-0710KL)
R15  value 1K  [0402-R-R]  (hidden comment: RC0402FR-071KL)
R16  value 1K  [0402-R-R]  (hidden comment: RC0402FR-071KL)
R17  value 1K  [0402-R-R]  (hidden comment: RC0402FR-071KL)
R18  value 1K  [0402-R-R]  (hidden comment: RC0402FR-071KL)
SW1  SKRPADE010  [SKRPADE010_AAL]
SW2  SKRPADE010  [SKRPADE010_AAL]
TP1  5001  [TEST_POINT]  (value not drawn)
TP2  5001  [TEST_POINT]  (value not drawn)
U2  IC MCU 32BIT 2MB FLASH 144UFBGA  [UFBGA144-10x10mm]  (parts A,B,C of 3)
X1  value 16 MHz  [XTAL_ECS-160-8-33Q-JES-TR]  (hidden comment: STDCRG1-16M)
X2  value 32.768 kHz  [XTAL_NX3215SA_NDK-M - duplicate]  (hidden comment: STDMUA14-32.768K)

### Blocks framed on the sheet
POWER and FILTERS: C28-C42 U2

### Ports
I2C_BUS (harness I2C), MCU (in, harness MCU), MCU_I2C2_SCL (bidir), MCU_I2C2_SDA (bidir), MCU_USART1_RX (bidir), MCU_USART1_TX (bidir)

### Harnesses
I2C: SCL, SDA
MCU: MCU_A[20..0], MCU_D[15..0], MCU_OE, MCU_WE, MCU_CS, MCU_UB, MCU_LB, MCU_WAIT

### Nets
3.3V: J1.2(VCC) R15.2 R16.2 R17.2 R18.2
GND: C22.1 C23.2 C24.2 C25.2 C26.2 C27.1 C28.1 C29.1 C30.1 C31.1 C32.1 C33.1 C34.1 C35.1 C36.1 C37.1 C38.1 C39.1 C40.1 C41.1 C42.1 D2.1(K) D3.1(K) J1.1(GND) J2.05(GND) J2.07(GND) J2.11(GND) R12.1 SW1.1 SW1.3 SW2.2 SW2.4 U2.A1(VSS) U2.A7(VSS) U2.A12(VSS) U2.C1(VSS) U2.F11(VSS) U2.G2(VSS) U2.J10(VSSDSI) U2.K1(VSSA/VREF-) U2.L6(VSS) U2.M1(VSS) U2.M12(VSS) X1.2(GND) X1.4(GND)
VCC_MCU: C28.2 C29.2 C30.2 C31.2 C32.2 C33.2 C34.2 C35.2 C36.2 C37.2 C38.2 C40.2 C41.2 C42.2 J2.03(VCC) R11.1 U2.A6(VDDIO2) U2.A11(VDD) U2.B1(VBAT) U2.B2(VDD) U2.C11(VDDUSB) U2.E12(VDDIO2) U2.G1(VDD) U2.G12(VDD) U2.K2(VREF+) U2.L1(VDDA) U2.L11(VDD) U2.M2(VDD) U2.M6(VDD)
BOOT: R12.2 U2.A4(PH3-BOOT0)
BUTTOM: C24.1 R11.2 SW1.2 SW1.4 U2.A5(PB4)
MCU_A0: U2.E3(PF0)
MCU_A1: U2.E2(PF1)
MCU_A2: U2.E1(PF2)
MCU_A3: U2.E5(PF3)
MCU_A4: U2.F3(PF4)
MCU_A5: U2.F4(PF5)
MCU_A6: U2.G5(PF12)
MCU_A7: U2.J6(PF13)
MCU_A8: U2.M7(PF14)
MCU_A9: U2.H6(PF15)
MCU_A10: U2.L7(PG0)
MCU_A11: U2.M8(PG1)
MCU_A12: U2.F12(PG2)
MCU_A13: U2.F7(PG3)
MCU_A14: U2.F10(PG4)
MCU_A15: U2.F8(PG5)
MCU_A16: U2.G11(PD11)
MCU_A17: U2.G9(PD12)
MCU_A18: U2.G10(PD13)
MCU_A19: U2.B3(PE3)
MCU_A20: U2.D3(PE4)
MCU_CS: U2.E7(PD7) ; port MCU.MCU_CS
MCU_D0: U2.G8(PD14)
MCU_D1: U2.G7(PD15)
MCU_D2: U2.C8(PD0)
MCU_D3: U2.B8(PD1)
MCU_D4: U2.G6(PE7)
MCU_D5: U2.K7(PE8)
MCU_D6: U2.J7(PE9)
MCU_D7: U2.L8(PE10)
MCU_D8: U2.H7(PE11)
MCU_D9: U2.M9(PE12)
MCU_D10: U2.J8(PE13)
MCU_D11: U2.M10(PE14)
MCU_D12: U2.K8(PE15)
MCU_D13: U2.H10(PD8)
MCU_D14: U2.H9(PD9)
MCU_D15: U2.H8(PD10)
MCU_LB: U2.A2(PE0) ; port MCU.MCU_LB
MCU_OE: U2.C7(PD4) ; port MCU.MCU_OE
MCU_UB: U2.C4(PE1) ; port MCU.MCU_UB
MCU_WAIT: port MCU.MCU_WAIT
MCU_WE: U2.D7(PD5) ; port MCU.MCU_WE
OSC32_IN: C26.1 U2.D1(PC14-OSC32_IN) X2.2
OSC32_OUT: C25.1 U2.D2(PC15-OSC32_OUT) X2.1
OSC_IN: C22.2 U2.H1(PH0-OSC_IN) X1.1
OSC_OUT: C23.1 U2.H2(PH1_OSC_OUT) X1.3
RESET: C27.2 J2.12(RSTN) SW2.1 SW2.3 U2.J1(NRST)
SWDCLK: J2.06(SWCLK) U2.A10(PA14)
SWDIO: J2.04(SWIO) U2.B10(PA13)
SWO: J2.08(SWO) U2.B6(PB3)
USART2_RX: J2.13(RX)
USART2_TX: J2.14(TX)
NetC39_2: C39.2 U2.L12(VCAPDSI)
NetD2_2: D2.2(A) R13.2
NetD3_2: D3.2(A) R14.1
NetJ1_3: J1.3(SCL) R18.1 ; port MCU_I2C2_SCL
NetJ1_4: J1.4(SDA) R17.1 ; port MCU_I2C2_SDA
NetR13_1: R13.1 U2.B9(PA15)
NetR15_1: R15.1 U2.A3(PB9) ; port I2C_BUS.SDA
NetR16_1: R16.1 U2.B4(PB8) ; port I2C_BUS.SCL
NetTP1_1: TP1.1 U2.C5(PB7) ; port MCU_USART1_RX
NetTP2_1: TP2.1 U2.D5(PB6) ; port MCU_USART1_TX

Not connected (* = marked no-connect by the designer): J2 01(NC)* 02(NC)* 09(NC)* 10(NC)*; R14 2; U2 A8(PD3) A9(PC11) B5(PB5) B7(PD6) B11(PA12) B12(PA11) C2(PE5) C3(PE2) C6(PG13) C9(PC10) C10(PA10) C12(PC9) D4(PE6) D6(PG12) D8(PD2) D9(PC12) D10(PA9) D11(PA8) D12(PC6) E4(PC13) E6(PG10) E8(PG8) E9(PC7) E10(PC8) E11(PG7) F1(PF8) F2(PF6) F5(PF7) F6(PG9) F9(PG6) G3(PF10) G4(PF9) H3(PC0) H4(PC2) H5(PB2) H11(DSI_D1P) H12(DSI_D1N) J2(PC1) J3(PC3) J4(PA6) J5(PB1) J9(PB15) J11(DSI_CKP) J12(DSI_CKN) K3(PA0) K4(PA4) K5(PC5) K6(PF11) K9(PB11) K10(PB14) K11(DSI_D0P) K12(DSI_D0N) L2(PA1) L3(PA2) L4(PA5) L5(PC4) L9(PB10) L10(PB12) M3(PA3) M4(PA7) M5(PB0) M11(PB13)

### Buses and harness runs
bus MCU_A[20..0]
bus MCU_D[15..0]

### Notes on the sheet
- Labels drawn without touching a wire or pin: MCU_CS, MCU_OE, MCU_WE, USART2_RX, USART2_TX
- (in symbol IC MCU 32BIT 2MB FLASH 144UFBGA, part A) 1 of 3
- (in symbol IC MCU 32BIT 2MB FLASH 144UFBGA, part B) 2 of 3
- (in symbol IC MCU 32BIT 2MB FLASH 144UFBGA, part C) 3 of 3
- (in symbol OLED DISPLAY) OLED DISPLAY 128x32

### Library data of the parts
C22 C23 = CAP CER 6.8PF 25V C0G/NP0 01005: 6.8 pF ±0.25pF 25V Ceramic Capacitor C0G, NP0 01005 (0402 Metric); TOLERANCE: 5%; SIZE: 0402; VOLTAGE: 25V; PN: GRM0225C1E6R8CA03L
C24 C27-C35 C37 C40 = CAP CER 0.1UF 25V X5R 0402: as C77 on sheet 02 - AUX_POWER_SUPPLIES; SIZE: 0402; PN: GRM155R61E104KA87D; VOLTAGE: 25V; TOLERANCE: 10%
C25 C26 = CAP CER 5.6PF 50V C0G/NPO 0402: 5.6 pF ±0.1pF 50V Ceramic Capacitor C0G, NP0 0402 (1005 Metric); TOLERANCE: 1%; SIZE: 0402; VOLTAGE: 50V; PN: CC0402BRNPO9BN5R6
C36 = CAP CER 4.7UF 25V X5R 0402: as C10 on sheet 01 - POWER SUPPLY; SIZE: 0402; VOLTAGE: 25V; TOLERANCE: 20%; PN: GRM155D81C475ME15J
C38 C41 = CAP CER 1UF 6.3V X5R 0402: as C12 on sheet 01 - POWER SUPPLY; SIZE: 0402; VOLTAGE: 6.3V; TOLERANCE: 10%; PN: JMK105BJ105KV-F
C39 = CAP CER 2.2UF 10V X5R 0402: 2.2 µF ±20% 10V Ceramic Capacitor X5R 0402 (1005 Metric); SIZE: 0402; VOLTAGE: 10V; TOLERANCE: 20%; PN: 885012105013
C42 = CAP CER 10nF 25V X7R 0402: 10000 pF ±10% 25V Ceramic Capacitor X7R 0402 (1005 Metric); SIZE: 0402; VOLTAGE: 25V; TOLERANCE: 10%; PN: KGM05AR71E103KH
D2 D3 = LED SMD VD 0603: as D4 on sheet 02 - AUX_POWER_SUPPLIES; ID: ?; PN: 150060GS75000
J2 = CONN HEADER SMD 14POS 1.27MM_1: CONN HEADER SMD 14POS 1.27MM PN: FTSH-107-01-L-DV-K-A; MF: Samtec Inc.; Package: None; Value: *; Price: None; PN: FTSH-107-01-L-DV-K-A; SnapEDA_Link: https://www.snapeda.com/parts/FTSH-107-01-L-DV-K-A/Samtec%20Inc./view-part/2791957/?ref=snap; Availability: Bad
R11 R13 = RES 10K OHM 1% 1/16W 0402: 10 kOhms ±1% 0,063W, 1/16W Resistor de chip 0402 (métrico 1005) Resistente à umidade Filme grosso; PACK: 0402; POWER: 0.063W; PN: RC0402FR-0710KL; TOLERANCE: 1%
R12 R14 = RES 10K OHM 1% 1/16W 0402: as R3 on sheet 01 - POWER SUPPLY; TOLERANCE: 1%; PN: RC0402FR-0710KL
R15-R18 = RES 1K OHM 1% 1/16W 0402: 1 kOhms ±1% 0.063W, 1/16W Chip Resistor 0402 (1005 Metric) Moisture Resistant Thick Film; PACK: 0402; POWER: 0.063W; TOLERANCE: 1%; PN: RC0402FR-071KL
SW1 SW2 = SWITCH TACTILE SPST-NO 0.05A 16V: Interruptor tátil SPST-NA Top atuado Montagem em superfície; Mfr_Name: Alps Electric; RefDes: RefDes; Type: Type; PN: SKRPADE010
TP1 TP2 = PC TEST POINT MINIATURE BLACK: PC TEST POINT MINIATURE BLACK PN: 5001; MF: Keystone Electronics Corp.; SnapEDA_Link: https://www.snapeda.com/parts/5001/Keystone+Electronics/view-part/?ref=snap; Package: None; Value: *; PN: 5001; Check_prices: https://www.snapeda.com/parts/5001/Keystone+Electronics/view-part/?ref=eda
U2 = IC MCU 32BIT 2MB FLASH 144UFBGA: ARM® Cortex®-M4 STM32L4 Microcontroller IC 32-Bit Single-Core 120MHz 2MB (2M x 8) FLASH 144-UFBGA (10x10) PN: STM32L4R9ZIJ6; Mfr_Name: STMicroelectronics; RefDes: RefDes; Type: Type; PN: STM32L4R9ZIJ6
X1 = CRYSTAL 16.0000MHZ 8PF SMD: 16 MHz ±20ppm Crystal 8pF 80 Ohms 4-SMD, No Lead; SnapEDA_Link: https://www.snapeda.com/parts/ECS-160-8-33Q-JES-TR/ECS/view-part/?ref=snap; Package: ECX-33Q-33Q-4 ECS; PN: STDCRG1-16M
X2 = CRYSTAL 32.7680KHZ 6PF SMD: 32.768 kHz ±20ppm Crystal 6pF 70 kOhms 2-SMD, No Lead; Mfr_Name: NDK; Type: Crystals; PN: STDMUA14-32.768K

## Sheet 06 - JTAG.SchDoc
size A3; SheetNumber: 6; SheetTotal: 7
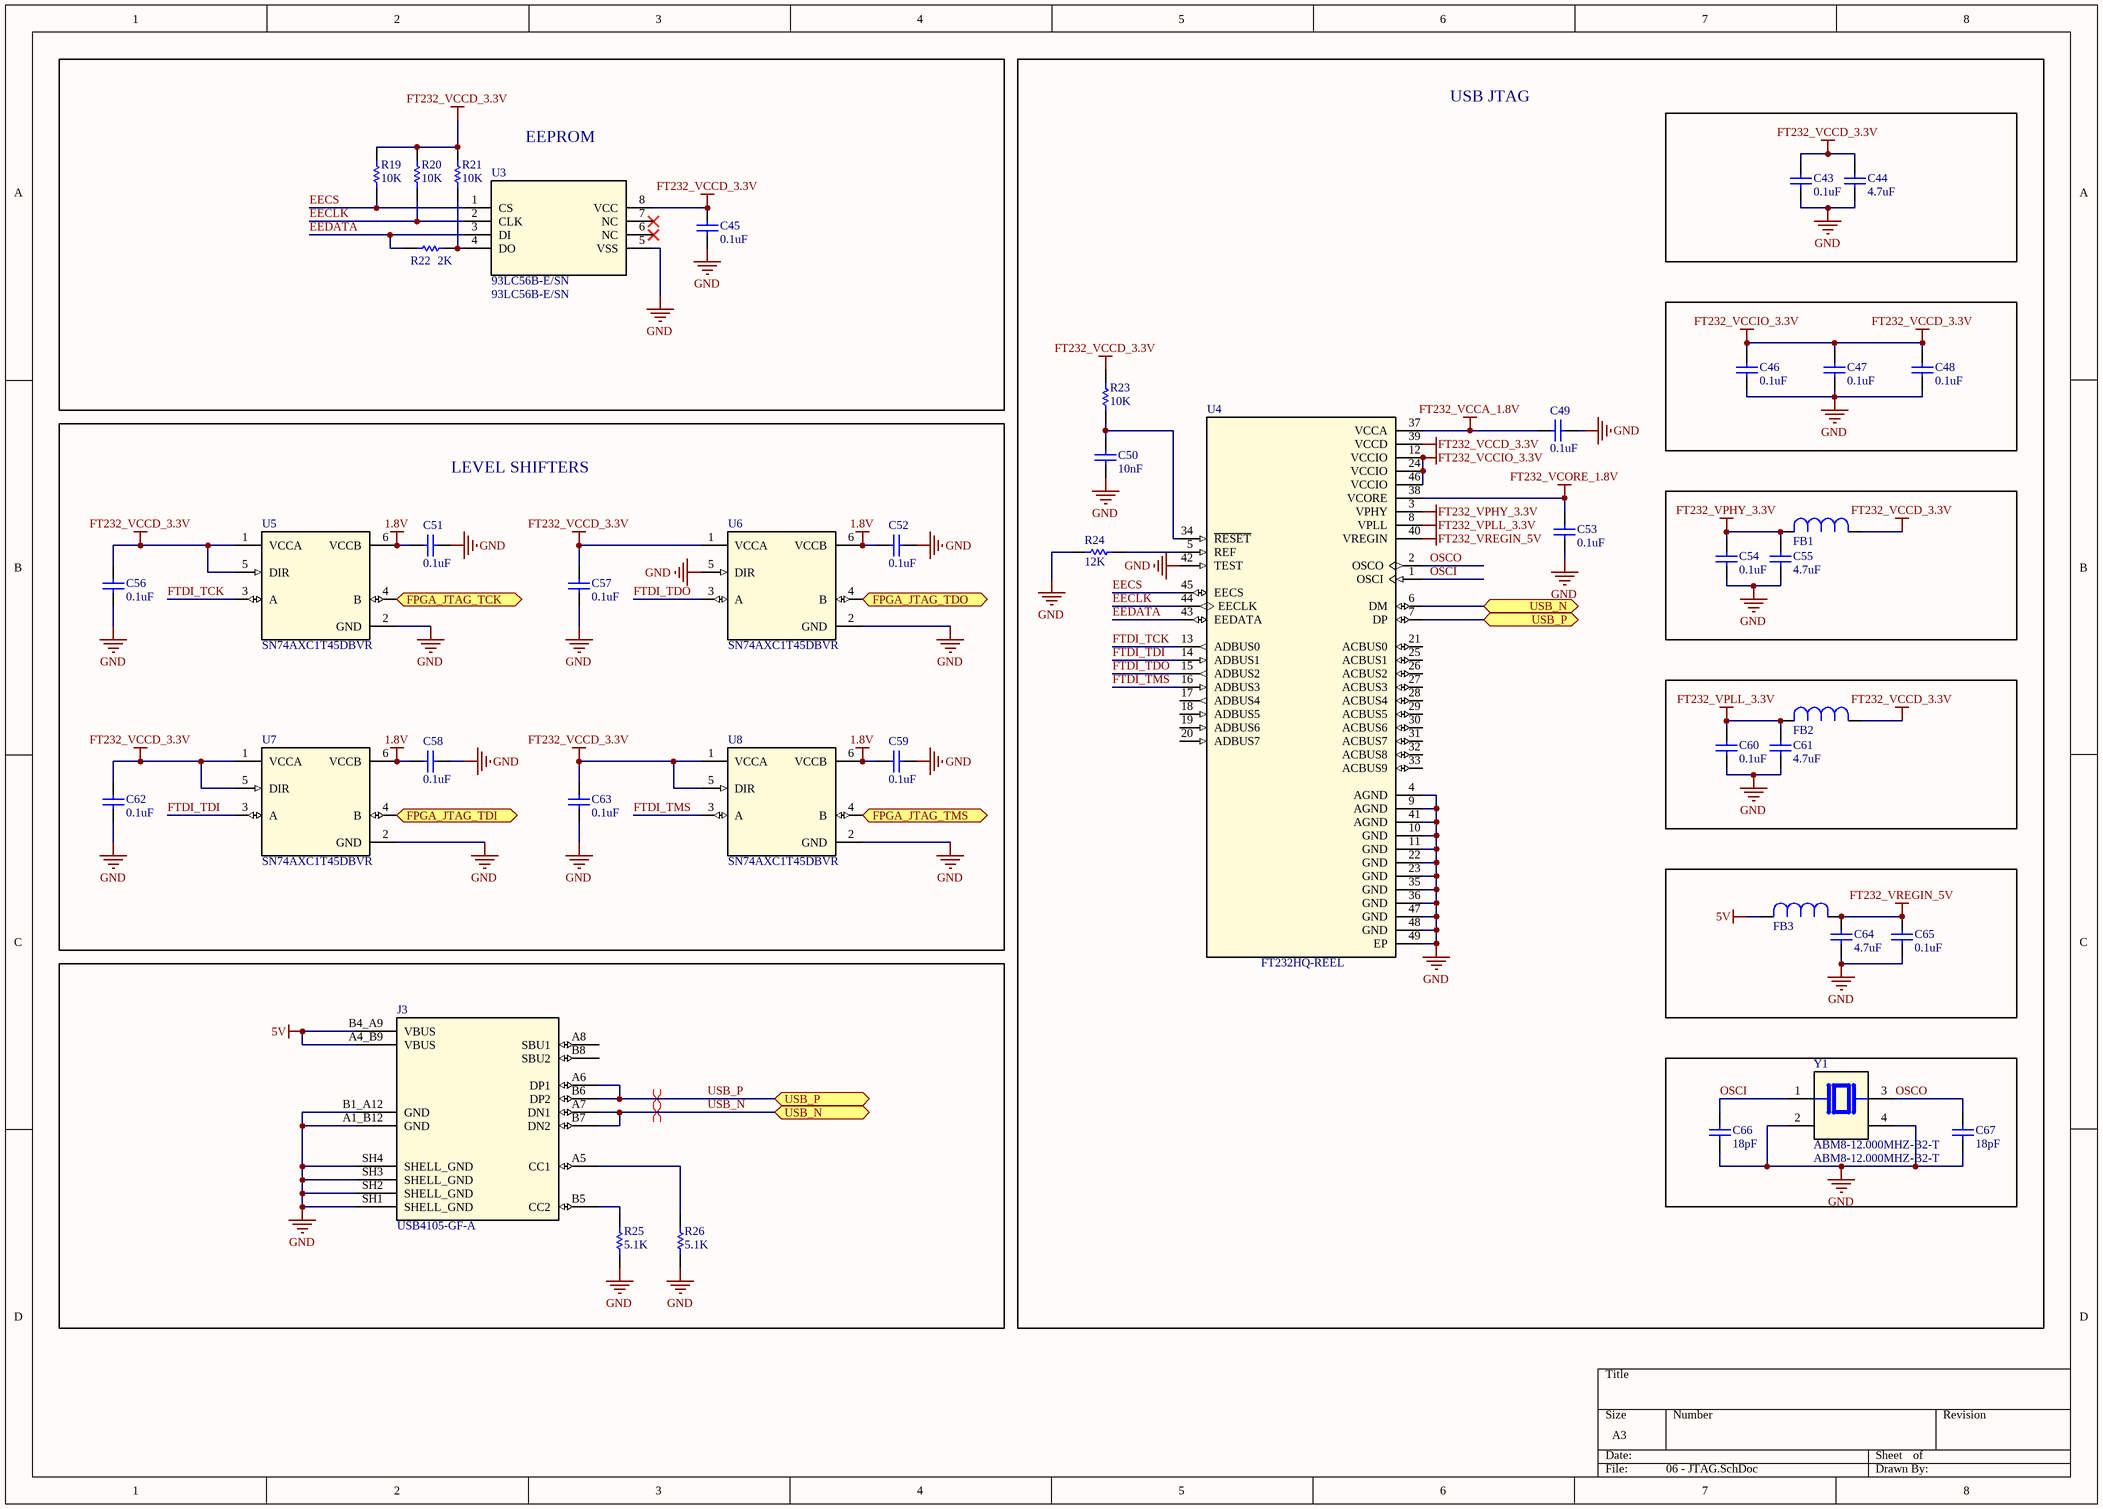
[diagram p5: 06 - JTAG.SchDoc]

### Parts
C43  value 0.1uF  [0402-C-R]  (hidden comment: GRM155R61E104KA87D)
C44  value 4.7uF  [0402-C-R]  (hidden comment: GRM155D81C475ME15J)
C45  value 0.1uF  [0402-C-R]  (hidden comment: GRM155R61E104KA87D)
C46  value 0.1uF  [0402-C-R]  (hidden comment: GRM155R61E104KA87D)
C47  value 0.1uF  [0402-C-R]  (hidden comment: GRM155R61E104KA87D)
C48  value 0.1uF  [0402-C-R]  (hidden comment: GRM155R61E104KA87D)
C49  value 0.1uF  [0402-C-R]  (hidden comment: GRM155R61E104KA87D)
C50  value 10nF  [0402-C-R]  (hidden comment: KGM05AR71E103KH)
C51  value 0.1uF  [0402-C-R]  (hidden comment: GRM155R61E104KA87D)
C52  value 0.1uF  [0402-C-R]  (hidden comment: GRM155R61E104KA87D)
C53  value 0.1uF  [0402-C-R]  (hidden comment: GRM155R61E104KA87D)
C54  value 0.1uF  [0402-C-R]  (hidden comment: GRM155R61E104KA87D)
C55  value 4.7uF  [0402-C-R]  (hidden comment: GRM155D81C475ME15J)
C56  value 0.1uF  [0402-C-R]  (hidden comment: GRM155R61E104KA87D)
C57  value 0.1uF  [0402-C-R]  (hidden comment: GRM155R61E104KA87D)
C58  value 0.1uF  [0402-C-R]  (hidden comment: GRM155R61E104KA87D)
C59  value 0.1uF  [0402-C-R]  (hidden comment: GRM155R61E104KA87D)
C60  value 0.1uF  [0402-C-R]  (hidden comment: GRM155R61E104KA87D)
C61  value 4.7uF  [0402-C-R]  (hidden comment: GRM155D81C475ME15J)
C62  value 0.1uF  [0402-C-R]  (hidden comment: GRM155R61E104KA87D)
C63  value 0.1uF  [0402-C-R]  (hidden comment: GRM155R61E104KA87D)
C64  value 4.7uF  [0402-C-R]  (hidden comment: GRM155D81C475ME15J)
C65  value 0.1uF  [0402-C-R]  (hidden comment: GRM155R61E104KA87D)
C66  value 18pF  [0402-C-R]  (hidden comment: GRM1555C1H180JA01D)
C67  value 18pF  [0402-C-R]  (hidden comment: GRM1555C1H180JA01D)
FB1  BLM15HD182SN1D  [0402-F-R]  (value not drawn)
FB2  BLM15HD182SN1D  [0402-F-R]  (value not drawn)
FB3  BLM15HD182SN1D  [0402-F-R]  (value not drawn)
J3  PN: USB4105-GF-A  [GCT_USB4105-GF-A]  (hidden comment: CONN RCP USB2.0 TYP C 24P SMD RA)
R19  value 10K  [0402-R-R]  (hidden comment: RC0402FR-0710KL)
R20  value 10K  [0402-R-R]  (hidden comment: RC0402FR-0710KL)
R21  value 10K  [0402-R-R]  (hidden comment: RC0402FR-0710KL)
R22  value 2K  [0402-R-R]  (hidden comment: RMCF0402FT2K00)
R23  value 10K  [0402-R-R]  (hidden comment: RC0402FR-0710KL)
R24  value 12K  [0402-R-R]  (hidden comment: RMCF0402FT12K0)
R25  value 5.1K  [0402-R-R]  (hidden comment: RMCF0402FT5K10)
R26  value 5.1K  [0402-R-R]  (hidden comment: RMCF0402FT5K10)
U3  93LC56B-E/SN  [93LC56B-E/SN]
U4  PN: FT232HQ-REEL  [FT232HQ]  (hidden comment: IC HS USB TO UART/FIFO 48QFN)
U5  SN74AXC1T45DBVR  [SN74AXC1T45DBVR]
U6  SN74AXC1T45DBVR  [SN74AXC1T45DBVR]
U7  SN74AXC1T45DBVR  [SN74AXC1T45DBVR]
U8  SN74AXC1T45DBVR  [SN74AXC1T45DBVR]
Y1  ABM8-12.000MHZ-B2-T  [XTAL_ABM8-12.000MHZ-B2-T]

### Blocks framed on the sheet
EEPROM: C45 R19-R22 U3
USB JTAG: C43 C44 C46-C50 C53-C55 C60 C61 C64-C67 FB1-FB3 R23 R24 U4 Y1
LEVEL SHIFTERS: C51 C52 C56-C59 C62 C63 U5-U8

### Ports
FPGA_JTAG_TCK (bidir), FPGA_JTAG_TDI (bidir), FPGA_JTAG_TDO (bidir), FPGA_JTAG_TMS (bidir), USB_N (bidir), USB_P (bidir)

### Nets
1.8V: C51.2 C52.2 C58.2 C59.2 U5.6(VCCB) U6.6(VCCB) U7.6(VCCB) U8.6(VCCB)
5V: FB3.2 J3.A4_B9(VBUS) J3.B4_A9(VBUS)
FT232_VCCA_1.8V: C49.2 U4.37(VCCA)
FT232_VCCD_3.3V: C43.2 C44.2 C45.2 C46.2 C47.2 C48.2 C56.2 C57.2 C62.2 C63.2 FB1.1 FB2.1 R19.2 R20.2 R21.2 R23.2 U3.8(VCC) U4.12(VCCIO) U4.24(VCCIO) U4.39(VCCD) U4.46(VCCIO) U5.1(VCCA) U5.5(DIR) U6.1(VCCA) U7.1(VCCA) U7.5(DIR) U8.1(VCCA) U8.5(DIR)  [also labelled FT232_VCCIO_3.3V]
FT232_VCORE_1.8V: C53.1 U4.38(VCORE)
FT232_VPHY_3.3V: C54.2 C55.2 FB1.2 U4.3(VPHY)
FT232_VPLL_3.3V: C60.2 C61.2 FB2.2 U4.8(VPLL)
FT232_VREGIN_5V: C64.2 C65.2 FB3.1 U4.40(VREGIN)
GND: C43.1 C44.1 C45.1 C46.1 C47.1 C48.1 C49.1 C50.1 C51.1 C52.1 C53.2 C54.1 C55.1 C56.1 C57.1 C58.1 C59.1 C60.1 C61.1 C62.1 C63.1 C64.1 C65.1 C66.1 C67.1 J3.A1_B12(GND) J3.B1_A12(GND) J3.SH1(SHELL_GND) J3.SH2(SHELL_GND) J3.SH3(SHELL_GND) J3.SH4(SHELL_GND) R24.1 R25.1 R26.1 U3.5(VSS) U4.4(AGND) U4.9(AGND) U4.10(GND) U4.11(GND) U4.22(GND) U4.23(GND) U4.35(GND) U4.36(GND) U4.41(AGND) U4.42(TEST) U4.47(GND) U4.48(GND) U4.49(EP) U5.2(GND) U6.2(GND) U6.5(DIR) U7.2(GND) U8.2(GND) Y1.2(GND) Y1.4(GND)
EECLK: R20.1 U3.2(CLK) U4.44(EECLK)
EECS: R19.1 U3.1(CS) U4.45(EECS)
EEDATA: R22.1 U3.3(DI) U4.43(EEDATA)
FTDI_TCK: U4.13(ADBUS0) U5.3(A)
FTDI_TDI: U4.14(ADBUS1) U7.3(A)
FTDI_TDO: U4.15(ADBUS2) U6.3(A)
FTDI_TMS: U4.16(ADBUS3) U8.3(A)
OSCI: C66.2 U4.1(OSCI) Y1.1
OSCO: C67.2 U4.2(OSCO) Y1.3
USB_N: J3.A7(DN1) J3.B7(DN2) U4.6(DM) ; port USB_N
USB_P: J3.A6(DP1) J3.B6(DP2) U4.7(DP) ; port USB_P
NetC50_2: C50.2 R23.1 U4.34(~{RESET})
NetJ3_A5: J3.A5(CC1) R26.2
NetJ3_B5: J3.B5(CC2) R25.2
NetR21_1: R21.1 R22.2 U3.4(DO)
NetR24_2: R24.2 U4.5(REF)
NetU5_4: U5.4(B) ; port FPGA_JTAG_TCK
NetU6_4: U6.4(B) ; port FPGA_JTAG_TDO
NetU7_4: U7.4(B) ; port FPGA_JTAG_TDI
NetU8_4: U8.4(B) ; port FPGA_JTAG_TMS

Not connected (* = marked no-connect by the designer): J3 A8(SBU1) B8(SBU2); U3 6(NC)* 7(NC)*; U4 17(ADBUS4) 18(ADBUS5) 19(ADBUS6) 20(ADBUS7) 21(ACBUS0) 25(ACBUS1) 26(ACBUS2) 27(ACBUS3) 28(ACBUS4) 29(ACBUS5) 30(ACBUS6) 31(ACBUS7) 32(ACBUS8) 33(ACBUS9)

### Layout directives
differential pair: USB_N, USB_P

### Library data of the parts
C43 C45-C49 C51-C54 C56-C60 C62 C63 C65 = CAP CER 0.1UF 25V X5R 0402: as C77 on sheet 02 - AUX_POWER_SUPPLIES; SIZE: 0402; PN: GRM155R61E104KA87D; VOLTAGE: 25V; TOLERANCE: 10%
C44 = CAP CER 4.7UF 10V X5R 0402: CAP SMD 0402 MLCC GERAL 4.7uF 25V ±20% 0402 X5s PN: GRM155D81C475ME15J MURATA; SIZE: 0402; VOLTAGE: 25V; TOLERANCE: 20%; PN: GRM155D81C475ME15J
C50 = CAP CER 10nF 25V X7R 0402: as C42 on sheet 05 - MCU; SIZE: 0402; VOLTAGE: 25V; TOLERANCE: 10%; PN: KGM05AR71E103KH
C55 C61 C64 = CAP CER 4.7UF 25V X5R 0402: as C10 on sheet 01 - POWER SUPPLY; SIZE: 0402; VOLTAGE: 25V; TOLERANCE: 20%; PN: GRM155D81C475ME15J
C66 C67 = CAP CER 18PF 50V C0G/NP0 0402: 18 pF ±5% 50V Capacitor de cerâmica C0G, NP0 0402 (métrico 1005)PN:GRM1555C1H180JA01D MURATA; SIZE: 0402; VOLTAGE: 50V; TOLERANCE: 5%; PN: GRM1555C1H180JA01D
FB1-FB3 = FERRITE BEAD 1.8K OHM 0402 1LN: FERRITE BEAD 1.8K OHM 0402 1LN PN: BLM15HD182SN1D; Mfr_Name: Murata; PN: BLM15HD182SN1D
J3 = CONN RCP USB2.0 TYP C 24P SMD RA: CONN RCP USB2.0 TYP C 24P SMD RA PN: USB4105-GF-A; MF: {'manufacturer': u'GCT'}; Package: None; Price: None; Availability: Unavailable; Value: *
R19-R21 R23 = RES 10K OHM 1% 1/16W 0402: as R3 on sheet 01 - POWER SUPPLY; TOLERANCE: 1%; PN: RC0402FR-0710KL
R22 = RES SMD 0402 2K 0.063W ±1%: RES SMD GERAL FILM 2K 0.063W ±1% 0402 7" TAPE PN: RMCF0402FT2K00 STACKPOLE; PACK: 0402; POWER: 0.063W; TOLERANCE: 1%; PN: RMCF0402FT2K00
R24 = RES SMD 0402 12K 0.063W ±1%: RES SMD GERAL FILM 12K 0.063W ±1% 0402 7" TAPE PN: RMCF0402FT12K0; PACK: 0402; POWER: 0.063W; TOLERANCE: 1%; PN: RMCF0402FT12K0
R25 R26 = RES SMD 0402 5.1K OHM 1% 1/16W: RES SMD 0402 5.1K OHM 1% 1/16W 0402 PN: RMCF0402FT5K10; PACK: 0402; TOLERANCE: 0.1%; POWER: 0.063W; PN: RMCF0402FT5K10
U3 = IC EEPROM 2KBIT MICROWIRE 8SOIC: EEPROM CI de memória 2Kbit Microwire 2 MHz 8-SOIC. PN: 93LC56B-E/SN; Mfr_Name: Microchip; RefDes: RefDes; Type: Type; PN: 93LC56B-E/SN
U4 = IC HS USB TO UART/FIFO 48QFN: USB Bridge, USB to UART,FIFO USB 2.0 UART, FIFO Interface 48-QFN (8x8) PN: FT232HQ-REEL; MF: FTDI, Future; MP: FT232HQ-REEL; SnapEDA_Link: https://www.snapeda.com/parts/FT232HQ-REEL/FTDI,%20Future%20Technology%20Devices%20International%20Ltd/view-part/52946/?ref=snap; Check_prices: https://www.snapeda.com/parts/FT232HQ-REEL/FTDI,%20Future%20Technology%20Devices%20International%20Ltd/view-part/52946/?ref=eda; Price: None; Availability: Good; Purchase-URL: https://pricing.snapeda.com/search/part/FT232HQ-REEL/?ref=eda; Package: QFN-48 FTDI; Value: *
U5-U8 = IC TRANSLATOR BIDIR SOT23-6: Nível de tensão Tradutor Bidirecional 1 Circuito 1 Canal 500Mbps SOT-23-6. PN: SN74AXC1T45DBVR; MF: Texas Instruments; SnapEDA_Link: https://www.snapeda.com/parts/SN74AXC1T45DBVR/Texas+Instruments/view-part/?ref=snap; Availability: In Stock; MP: SN74AXC1T45DBVR; Price: None; Purchase-URL: https://pricing.snapeda.com/search/part/SN74AXC1T45DBVR/?ref=eda; Check_prices: https://www.snapeda.com/parts/SN74AXC1T45DBVR/Texas+Instruments/view-part/?ref=eda; Package: SOT-23-6 Texas Instruments; Parameter 1: *; Value: *; PN: SN74AXC1T45DBVR
Y1 = CRYSTAL 12.0000MHZ 18PF SMD: 12 MHz ±20ppm Cristal 18pF 120 Ohms 4-SMD, sem condutores PN: ABM8-12.000MHZ-B2-T; MF: Abracon; SnapEDA_Link: https://www.snapeda.com/parts/ABM8-12.000MHZ-B2-T/Abracon+LLC/view-part/?ref=snap; Price: None; Value: *; MP: ABM8-12.000MHZ-B2-T; Check_prices: https://www.snapeda.com/parts/ABM8-12.000MHZ-B2-T/Abracon+LLC/view-part/?ref=eda; Availability: In Stock; Package: NON-STANDARD-4 Abracon; Purchase-URL: https://pricing.snapeda.com/search/part/ABM8-12.000MHZ-B2-T/?ref=eda; PN: ABM8-12.000MHZ-B2-T

## Sheet 07 - CONNECTOR_CSKB.SchDoc
size A4; SheetNumber: 7; SheetTotal: 7
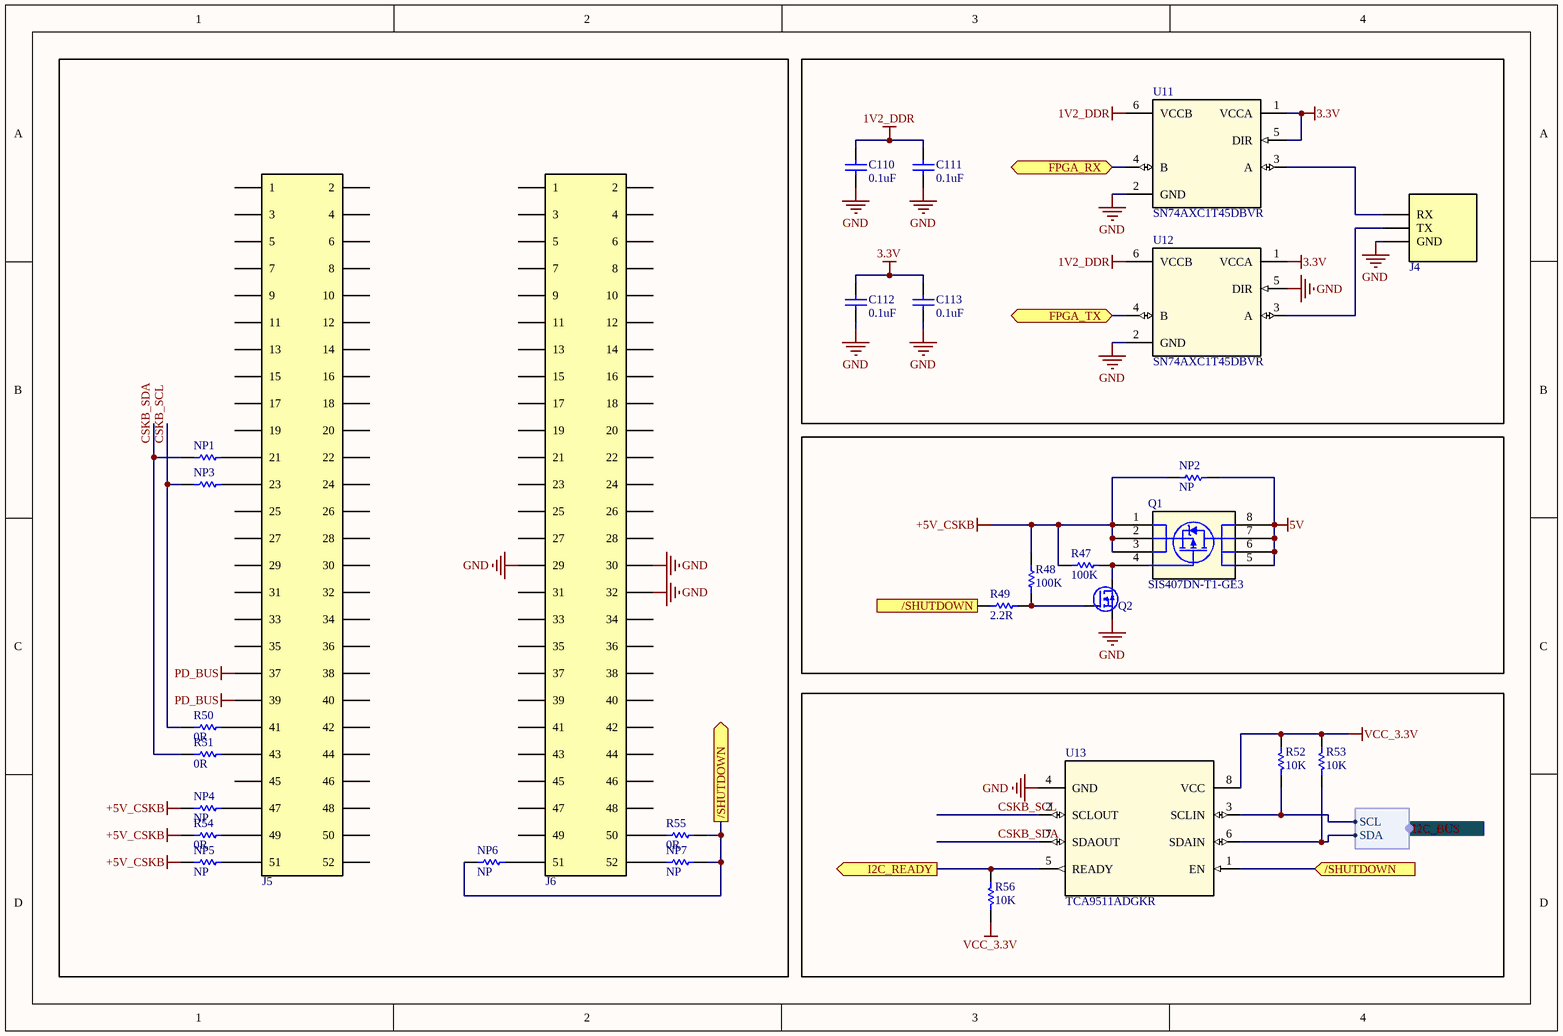
[diagram p6: 07 - CONNECTOR_CSKB.SchDoc]

### Parts
C110  value 0.1uF  [0402-C-R]  (hidden comment: GRM155R61E104KA87D)
C111  value 0.1uF  [0402-C-R]  (hidden comment: GRM155R61E104KA87D)
C112  value 0.1uF  [0402-C-R]  (hidden comment: GRM155R61E104KA87D)
C113  value 0.1uF  [0402-C-R]  (hidden comment: GRM155R61E104KA87D)
J4  CONN PTH 3PIN  [CONNECTOR BATTERY]  (value not drawn)
J5  ESQ-126-39-G-D  [SAMTEC_ESQ-126-39-G-D]  (value not drawn)
J6  ESQ-126-39-G-D  [SAMTEC_ESQ-126-39-G-D]  (value not drawn)
NP1  NP  [0402-R-NP]  (value not drawn)
NP2  NP  [0402-R-NP]
NP3  NP  [0402-R-NP]  (value not drawn)
NP4  NP  [0402-R-NP]
NP5  NP  [0402-R-NP]
NP6  NP  [0402-R-NP]
NP7  NP  [0402-R-NP]
Q1  SIS407DN-T1-GE3  [SIS413DN-T1-GE3_VIS]
Q2  IRF8010PBF  [SC70-6L_VIS]  (value not drawn)
R47  value 100K  [0402-R-R]  (hidden comment: RMCF0402FT100K)
R48  value 100K  [0402-R-R]  (hidden comment: RMCF0402FT100K)
R49  value 2.2R  [0402-R-R]  (hidden comment: RC0402FR-072R2L)
R50  value 0R  [0402-R-R]  (hidden comment: RMCF0402ZT0R00)
R51  value 0R  [0402-R-R]  (hidden comment: RMCF0402ZT0R00)
R52  value 10K  [0402-R-R]  (hidden comment: RMCF0402FT10K0)
R53  value 10K  [0402-R-R]  (hidden comment: RMCF0402FT10K0)
R54  value 0R  [0402-R-R]  (hidden comment: RMCF0402ZT0R00)
R55  value 0R  [0402-R-R]  (hidden comment: RMCF0402ZT0R00)
R56  value 10K  [0402-R-R]  (hidden comment: RMCF0402FT10K0)
U11  SN74AXC1T45DBVR  [SN74AXC1T45DBVR]
U12  SN74AXC1T45DBVR  [SN74AXC1T45DBVR]
U13  TCA9511ADGKR  [DGK0008A_L]

### Ports
/SHUTDOWN (in), /SHUTDOWN (out), FPGA_RX (bidir), FPGA_TX (bidir), I2C_BUS (harness I2C), I2C_READY (out)

### Harnesses
I2C: SCL, SDA

### Nets
1V2_DDR: C110.2 C111.2 U11.6(VCCB) U12.6(VCCB)
3.3V: C112.2 C113.2 U11.1(VCCA) U11.5(DIR) U12.1(VCCA)
5V: NP2.2 Q1.5(D) Q1.6(D) Q1.7(D) Q1.8(D)
+5V_CSKB: NP2.1 NP4.1 NP5.1 Q1.1(S) Q1.2(S) Q1.3(S) R47.2 R48.2 R54.1
GND: C110.1 C111.1 C112.1 C113.1 J4.1(GND) J6.29 J6.30 J6.32 Q2.4,7(S) U11.2(GND) U12.2(GND) U12.5(DIR) U13.4(GND)
PD_BUS: J5.37 J5.39
VCC_3.3V: R52.2 R53.2 R56.1 U13.8(VCC)
CSKB_SCL: NP3.1 R50.1 U13.2(SCLOUT)
CSKB_SDA: NP1.1 R51.1 U13.7(SDAOUT)
NetJ4_2: J4.2(TX) U12.3(A)
NetJ4_3: J4.3(RX) U11.3(A)
NetJ5_21: J5.21 NP1.2
NetJ5_23: J5.23 NP3.2
NetJ5_41: J5.41 R50.2
NetJ5_43: J5.43 R51.2
NetJ5_47: J5.47 NP4.2
NetJ5_49: J5.49 R54.2
NetJ5_51: J5.51 NP5.2
NetJ6_50: J6.50 R55.1
NetJ6_51: J6.51 NP6.2
NetJ6_52: J6.52 NP7.1
NetNP6_1: NP6.1 NP7.2 R49.1 R55.2 U13.1(EN) ; port /SHUTDOWN
NetQ1_4: Q1.4(G) Q2.1,2,5,6(D) R47.1
NetQ2_3: Q2.3(G) R48.1 R49.2
NetR15_1: R53.1 U13.6(SDAIN) ; port I2C_BUS.SDA
NetR16_1: R52.1 U13.3(SCLIN) ; port I2C_BUS.SCL
NetR56_2: R56.2 U13.5(READY) ; port I2C_READY
NetU11_4: U11.4(B) ; port FPGA_RX
NetU12_4: U12.4(B) ; port FPGA_TX

Not connected (* = marked no-connect by the designer): J5 01(1) 02(2) 03(3) 04(4) 05(5) 06(6) 07(7) 08(8) 09(9) 10 11 12 13 14 15 16 17 18 19 20 22 24 25 26 27 28 29 30 31 32 33 34 35 36 38 40 42 44 45 46 48 50 52; J6 01(1) 02(2) 03(3) 04(4) 05(5) 06(6) 07(7) 08(8) 09(9) 10 11 12 13 14 15 16 17 18 19 20 21 22 23 24 25 26 27 28 31 33 34 35 36 37 38 39 40 41 42 43 44 45 46 47 48 49

### Library data of the parts
C110-C113 = CAP CER 0.1UF 25V X5R 0402: as C77 on sheet 02 - AUX_POWER_SUPPLIES; SIZE: 0402; PN: GRM155R61E104KA87D; VOLTAGE: 25V; TOLERANCE: 10%
J5 J6 = CONN SOCKET 52POS 0.1 GOLD PCB: CONN SOCKET 52POS 0.1 GOLD PCB PN: ESQ-126-39-G-D; MF: Samtec; Package: None; PN: ESQ-126-39-G-D; Value: *; Availability: Unavailable; Price: None; SnapEDA_Link: https://www.snapeda.com/parts/ESQ-126-39-G-D/Samtec%20Inc./view-part/490181/?ref=snap
NP1-NP7 = RES SMD 0402 NP: PACK: 0402; VALUE: NP
Q1 = MOSFET P-CH 20V 9.5mOhm  25A: MOSFET P-CH 20V 25A 9.5mOhm PPAK1212-8 PN: SIS407DN-T1-GE3; Mfr_Name: Vishay; RefDes: RefDes; Type: Type; PN: SIS407DN-T1-GE3
Q2 = MOSFET N-CH 8V 12A PPAK SC70-6: MOSFET N-CH 8V 12A PPAK SC70-6 PN: SIA436DJ-T1-GE3; ID: 5714; CÓDIGO: 1003180105; PN: SIA436DJ-T1-GE3
R47 R48 = RES SMD 0402 100K 0.063W ±1%: RES SMD GERAL FILM 100K 0.063W ±1% 0402 7" TAPE PN: RMCF0402FT100K; PACK: 0402; POWER: 0.063W; TOLERANCE: 1%; PN: RMCF0402FT100K
R49 = RES SMD 0402 2.2R 0.063W ±1%: as R2 on sheet 01 - POWER SUPPLY; POWER: 0.063W; TOLERANCE: 1%; PN: RC0402FR-072R2L
R50 R51 R54 R55 = RES SMD 0402 0R 0.063W ±1%: as R1 on sheet 01 - POWER SUPPLY; TOLERANCE: 1%; POWER: 0.063W; PN: RMCF0402ZT0R00
R52 R53 R56 = RES SMD 0402 10K 0.063W ±1%: RES SMD GERAL FILM 10K 0.063W ±1% 0402 7" TAPE PN: RMCF0402FT10K0 STACKPOLE; PACK: 0402; POWER: 0.063W; TOLERANCE: 1%; PN: RMCF0402FT10K0
U11 U12 = IC TRANSLATOR BIDIR SOT23-6: as U5 on sheet 06 - JTAG; SnapEDA_Link: https://www.snapeda.com/parts/SN74AXC1T45DBVR/Texas+Instruments/view-part/?ref=snap; Availability: In Stock; MP: SN74AXC1T45DBVR; Price: None; Purchase-URL: https://pricing.snapeda.com/search/part/SN74AXC1T45DBVR/?ref=eda; Check_prices: https://www.snapeda.com/parts/SN74AXC1T45DBVR/Texas+Instruments/view-part/?ref=eda; Package: SOT-23-6 Texas Instruments; Parameter 1: *; Value: *; PN: SN74AXC1T45DBVR
U13 = IC BUFFET I2C 1 CHANNEL 8-VSSOP: Buffer, Accelerator 1 Channel 8-VSSOP PN: TCA9511ADGKR; Manufacturer_Name: Texas Instruments; CompType: IC; TYPE: TYPE; RefDes: RefDes; Copyright: Copyright (C) 2025 Ultra Librarian. All rights reserved.; Manufacturer_Part_Number: TCA9511ADGKR; Datasheet: https://www.ti.com/lit/gpn/tca9511a; PN: TCA9511ADGKR; PackageReference: DGK0008A; MountType: SMT; Manufacturer: Texas Instruments

## Nets that join several sheets
1.8V: 02 - AUX_POWER_SUPPLIES (6 pins), 04 - SRAM_FLASH (B1.D6 B1.E1 B2.D6 B2.E1), 06 - JTAG (8 pins)
1V2_DDR: 02 - AUX_POWER_SUPPLIES (6 pins), 07 - CONNECTOR_CSKB (C110.2 C111.2 U11.6 U12.6)
3.3V: 01 - POWER SUPPLY (R3.2 R7.1), 02 - AUX_POWER_SUPPLIES (R43.2), 04 - SRAM_FLASH (7 pins), 05 - MCU (5 pins), 07 - CONNECTOR_CSKB (5 pins)
5V: 01 - POWER SUPPLY (6 pins), 02 - AUX_POWER_SUPPLIES (6 pins), 06 - JTAG (FB3.2 J3.A4_B9 J3.B4_A9), 07 - CONNECTOR_CSKB (5 pins)
GND: 01 - POWER SUPPLY (14 pins), 02 - AUX_POWER_SUPPLIES (45 pins), 04 - SRAM_FLASH (11 pins), 05 - MCU (45 pins), 06 - JTAG (55 pins), 07 - CONNECTOR_CSKB (13 pins)
PD_BUS: 02 - AUX_POWER_SUPPLIES (8 pins), 07 - CONNECTOR_CSKB (J5.37 J5.39)
NetR15_1: 01 - POWER SUPPLY (U1.9), 02 - AUX_POWER_SUPPLIES (U9.42), 05 - MCU (R15.1 U2.A3), 07 - CONNECTOR_CSKB (R53.1 U13.6)
NetR16_1: 01 - POWER SUPPLY (U1.10), 02 - AUX_POWER_SUPPLIES (U9.43), 05 - MCU (R16.1 U2.B4), 07 - CONNECTOR_CSKB (R52.1 U13.3)